# EAGLE design Light Sensor - Teensy (EAGLE 8.6.0)
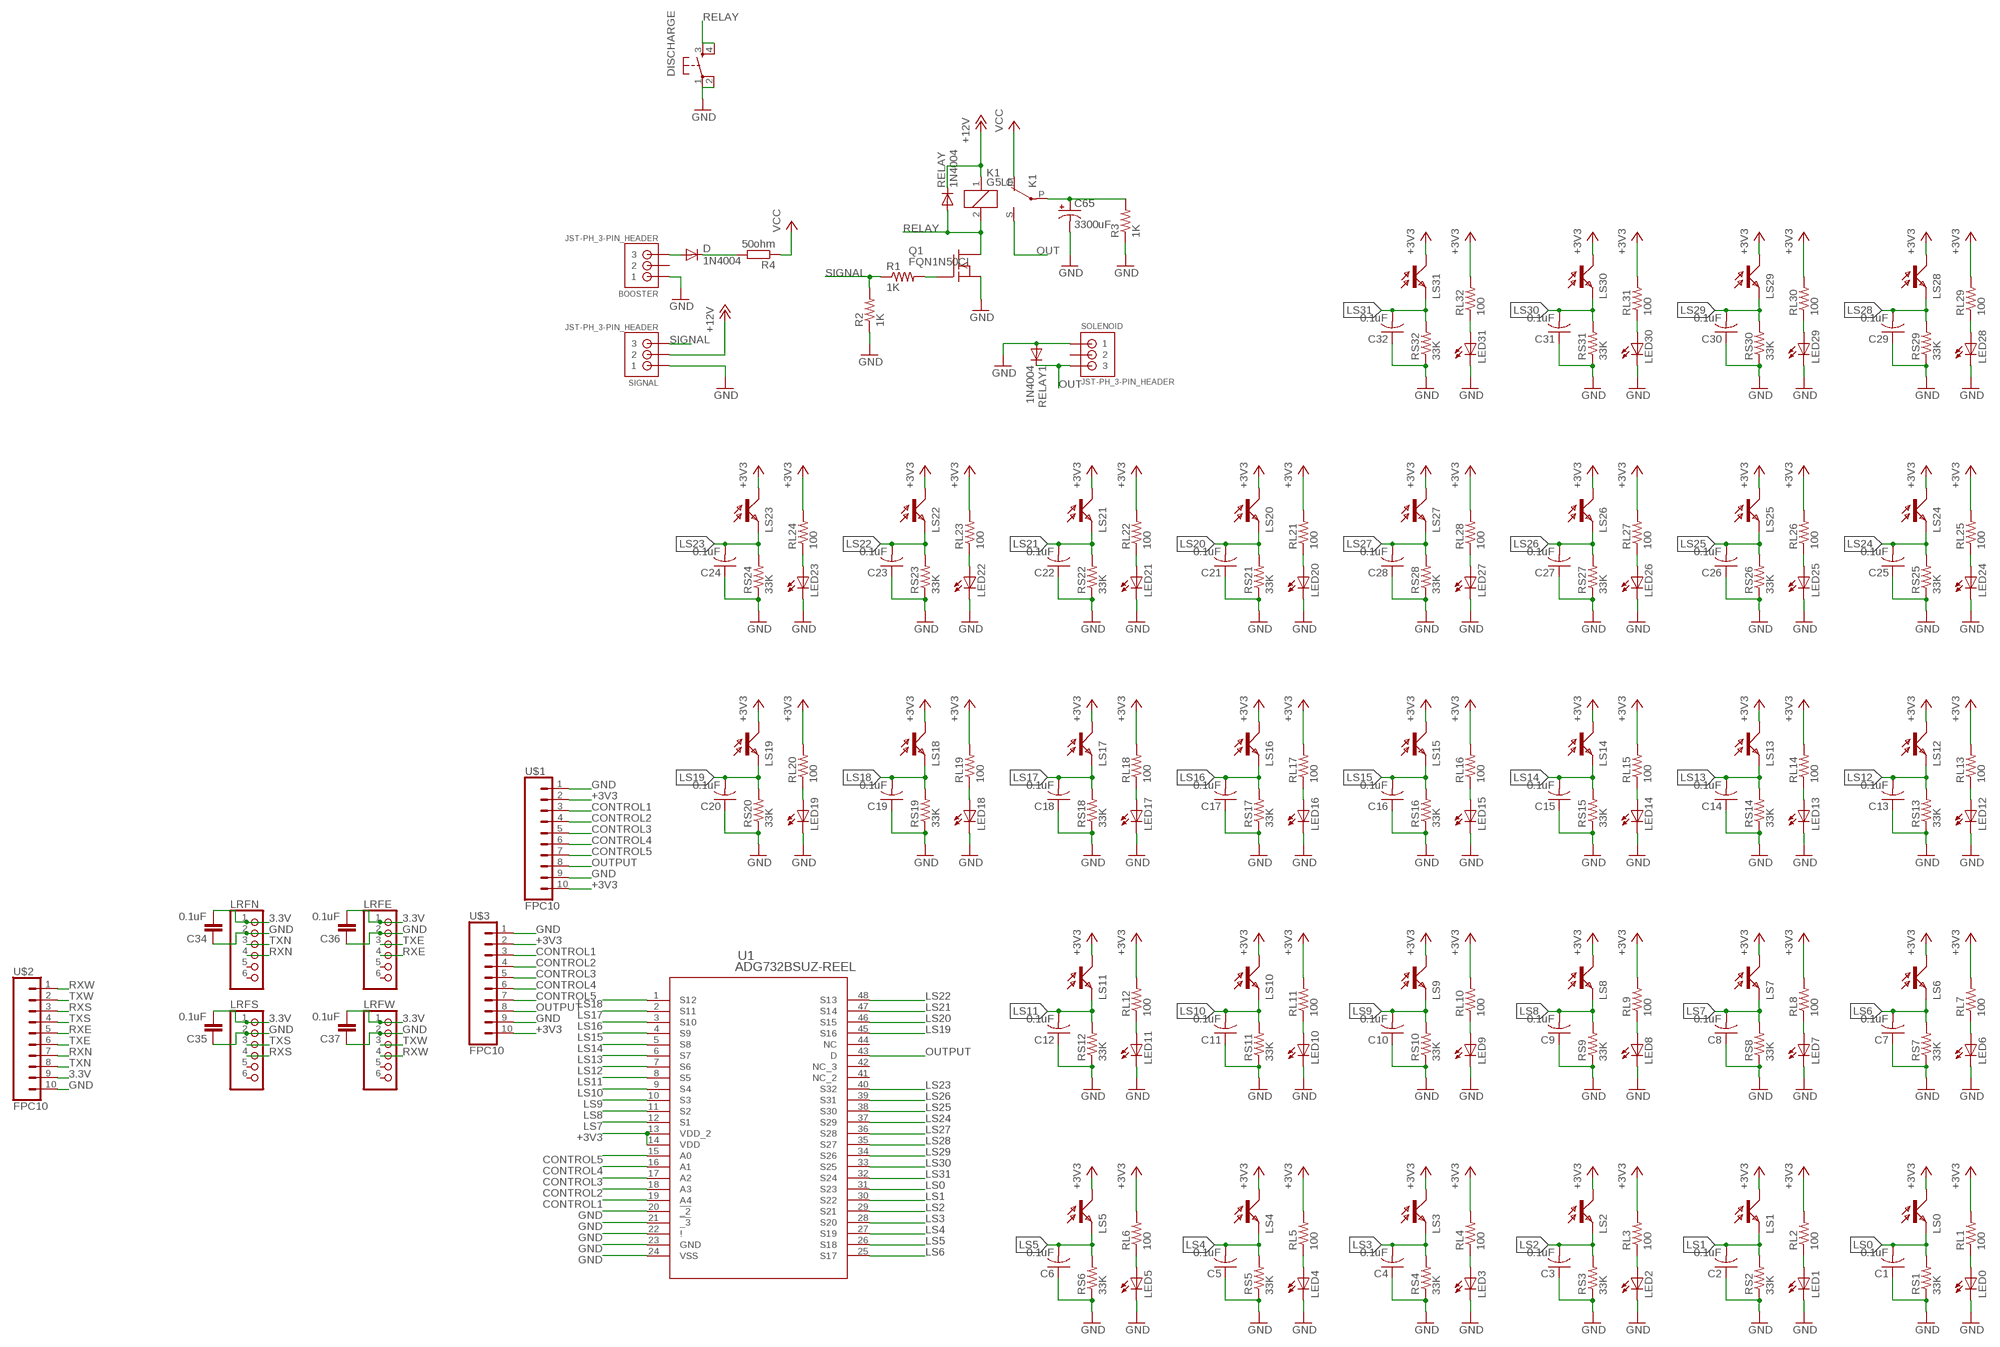
[diagram p0: schematic, sheet 1]

## Parts
BOOSTER  JST-PH_3-PIN_HEADER  [JST_B3B-PH_HEADER]
C1  0.1uF  C-USC0603  [C0603]
C2  0.1uF  C-USC0603  [C0603]
C3  0.1uF  C-USC0603  [C0603]
C4  0.1uF  C-USC0603  [C0603]
C5  0.1uF  C-USC0603  [C0603]
C6  0.1uF  C-USC0603  [C0603]
C7  0.1uF  C-USC0603  [C0603]
C8  0.1uF  C-USC0603  [C0603]
C9  0.1uF  C-USC0603  [C0603]
C10  0.1uF  C-USC0603  [C0603]
C11  0.1uF  C-USC0603  [C0603]
C12  0.1uF  C-USC0603  [C0603]
C13  0.1uF  C-USC0603  [C0603]
C14  0.1uF  C-USC0603  [C0603]
C15  0.1uF  C-USC0603  [C0603]
C16  0.1uF  C-USC0603  [C0603]
C17  0.1uF  C-USC0603  [C0603]
C18  0.1uF  C-USC0603  [C0603]
C19  0.1uF  C-USC0603  [C0603]
C20  0.1uF  C-USC0603  [C0603]
C21  0.1uF  C-USC0603  [C0603]
C22  0.1uF  C-USC0603  [C0603]
C23  0.1uF  C-USC0603  [C0603]
C24  0.1uF  C-USC0603  [C0603]
C25  0.1uF  C-USC0603  [C0603]
C26  0.1uF  C-USC0603  [C0603]
C27  0.1uF  C-USC0603  [C0603]
C28  0.1uF  C-USC0603  [C0603]
C29  0.1uF  C-USC0603  [C0603]
C30  0.1uF  C-USC0603  [C0603]
C31  0.1uF  C-USC0603  [C0603]
C32  0.1uF  C-USC0603  [C0603]
C34  0.1uF  0.1UF-0603-25V-(+80/-20%)  [0603]
C35  0.1uF  0.1UF-0603-25V-(+80/-20%)  [0603]
C36  0.1uF  0.1UF-0603-25V-(+80/-20%)  [0603]
C37  0.1uF  0.1UF-0603-25V-(+80/-20%)  [0603]
C65  3300uF  CPOL-USE10-22.5  [EB22,5D]
D  1N4004  [DO41-10]
DISCHARGE  TAC_SWITCHPTH  [TACTILE-PTH]
K1  G5LE  [G5LE]
LED0  LEDCHIPLED_0603  [CHIPLED_0603]
LED1  LEDCHIPLED_0603  [CHIPLED_0603]
LED2  LEDCHIPLED_0603  [CHIPLED_0603]
LED3  LEDCHIPLED_0603  [CHIPLED_0603]
LED4  LEDCHIPLED_0603  [CHIPLED_0603]
LED5  LEDCHIPLED_0603  [CHIPLED_0603]
LED6  LEDCHIPLED_0603  [CHIPLED_0603]
LED7  LEDCHIPLED_0603  [CHIPLED_0603]
LED8  LEDCHIPLED_0603  [CHIPLED_0603]
LED9  LEDCHIPLED_0603  [CHIPLED_0603]
LED10  LEDCHIPLED_0603  [CHIPLED_0603]
LED11  LEDCHIPLED_0603  [CHIPLED_0603]
LED12  LEDCHIPLED_0603  [CHIPLED_0603]
LED13  LEDCHIPLED_0603  [CHIPLED_0603]
LED14  LEDCHIPLED_0603  [CHIPLED_0603]
LED15  LEDCHIPLED_0603  [CHIPLED_0603]
LED16  LEDCHIPLED_0603  [CHIPLED_0603]
LED17  LEDCHIPLED_0603  [CHIPLED_0603]
LED18  LEDCHIPLED_0603  [CHIPLED_0603]
LED19  LEDCHIPLED_0603  [CHIPLED_0603]
LED20  LEDCHIPLED_0603  [CHIPLED_0603]
LED21  LEDCHIPLED_0603  [CHIPLED_0603]
LED22  LEDCHIPLED_0603  [CHIPLED_0603]
LED23  LEDCHIPLED_0603  [CHIPLED_0603]
LED24  LEDCHIPLED_0603  [CHIPLED_0603]
LED25  LEDCHIPLED_0603  [CHIPLED_0603]
LED26  LEDCHIPLED_0603  [CHIPLED_0603]
LED27  LEDCHIPLED_0603  [CHIPLED_0603]
LED28  LEDCHIPLED_0603  [CHIPLED_0603]
LED29  LEDCHIPLED_0603  [CHIPLED_0603]
LED30  LEDCHIPLED_0603  [CHIPLED_0603]
LED31  LEDCHIPLED_0603  [CHIPLED_0603]
LRFE  PINHD-1X6  [1X06]
LRFN  PINHD-1X6  [1X06]
LRFS  PINHD-1X6  [1X06]
LRFW  PINHD-1X6  [1X06]
LS0  ALS  [SMD]
LS1  ALS  [SMD]
LS2  ALS  [SMD]
LS3  ALS  [SMD]
LS4  ALS  [SMD]
LS5  ALS  [SMD]
LS6  ALS  [SMD]
LS7  ALS  [SMD]
LS8  ALS  [SMD]
LS9  ALS  [SMD]
LS10  ALS  [SMD]
LS11  ALS  [SMD]
LS12  ALS  [SMD]
LS13  ALS  [SMD]
LS14  ALS  [SMD]
LS15  ALS  [SMD]
LS16  ALS  [SMD]
LS17  ALS  [SMD]
LS18  ALS  [SMD]
LS19  ALS  [SMD]
LS20  ALS  [SMD]
LS21  ALS  [SMD]
LS22  ALS  [SMD]
LS23  ALS  [SMD]
LS24  ALS  [SMD]
LS25  ALS  [SMD]
LS26  ALS  [SMD]
LS27  ALS  [SMD]
LS28  ALS  [SMD]
LS29  ALS  [SMD]
LS30  ALS  [SMD]
LS31  ALS  [SMD]
Q1  FQN1N50CI  [TO92-INLINE]
R1  1K  1KOHM-1/4W-1%(PTH)  [AXIAL-0.3]
R2  1K  1KOHM-1/4W-1%(PTH)  [AXIAL-0.3]
R3  1K  1KOHM-1/4W-1%(PTH)  [AXIAL-0.3]
R4  50ohm  R0207/10  [0207/10]
RELAY  1N4004  [DO41-10]
RELAY1  1N4004  [DO41-10]
RL1  100  R-US_R0603  [R0603]
RL2  100  R-US_R0603  [R0603]
RL3  100  R-US_R0603  [R0603]
RL4  100  R-US_R0603  [R0603]
RL5  100  R-US_R0603  [R0603]
RL6  100  R-US_R0603  [R0603]
RL7  100  R-US_R0603  [R0603]
RL8  100  R-US_R0603  [R0603]
RL9  100  R-US_R0603  [R0603]
RL10  100  R-US_R0603  [R0603]
RL11  100  R-US_R0603  [R0603]
RL12  100  R-US_R0603  [R0603]
RL13  100  R-US_R0603  [R0603]
RL14  100  R-US_R0603  [R0603]
RL15  100  R-US_R0603  [R0603]
RL16  100  R-US_R0603  [R0603]
RL17  100  R-US_R0603  [R0603]
RL18  100  R-US_R0603  [R0603]
RL19  100  R-US_R0603  [R0603]
RL20  100  R-US_R0603  [R0603]
RL21  100  R-US_R0603  [R0603]
RL22  100  R-US_R0603  [R0603]
RL23  100  R-US_R0603  [R0603]
RL24  100  R-US_R0603  [R0603]
RL25  100  R-US_R0603  [R0603]
RL26  100  R-US_R0603  [R0603]
RL27  100  R-US_R0603  [R0603]
RL28  100  R-US_R0603  [R0603]
RL29  100  R-US_R0603  [R0603]
RL30  100  R-US_R0603  [R0603]
RL31  100  R-US_R0603  [R0603]
RL32  100  R-US_R0603  [R0603]
RS1  33K  R-US_R0603  [R0603]
RS2  33K  R-US_R0603  [R0603]
RS3  33K  R-US_R0603  [R0603]
RS4  33K  R-US_R0603  [R0603]
RS5  33K  R-US_R0603  [R0603]
RS6  33K  R-US_R0603  [R0603]
RS7  33K  R-US_R0603  [R0603]
RS8  33K  R-US_R0603  [R0603]
RS9  33K  R-US_R0603  [R0603]
RS10  33K  R-US_R0603  [R0603]
RS11  33K  R-US_R0603  [R0603]
RS12  33K  R-US_R0603  [R0603]
RS13  33K  R-US_R0603  [R0603]
RS14  33K  R-US_R0603  [R0603]
RS15  33K  R-US_R0603  [R0603]
RS16  33K  R-US_R0603  [R0603]
RS17  33K  R-US_R0603  [R0603]
RS18  33K  R-US_R0603  [R0603]
RS19  33K  R-US_R0603  [R0603]
RS20  33K  R-US_R0603  [R0603]
RS21  33K  R-US_R0603  [R0603]
RS22  33K  R-US_R0603  [R0603]
RS23  33K  R-US_R0603  [R0603]
RS24  33K  R-US_R0603  [R0603]
RS25  33K  R-US_R0603  [R0603]
RS26  33K  R-US_R0603  [R0603]
RS27  33K  R-US_R0603  [R0603]
RS28  33K  R-US_R0603  [R0603]
RS29  33K  R-US_R0603  [R0603]
RS30  33K  R-US_R0603  [R0603]
RS31  33K  R-US_R0603  [R0603]
RS32  33K  R-US_R0603  [R0603]
SIGNAL  JST-PH_3-PIN_HEADER  [JST_B3B-PH_HEADER]
SOLENOID  JST-PH_3-PIN_HEADER  [JST_B3B-PH_HEADER]
U1  ADG732BSUZ-REEL  [SU_48]
U$1  FPC10  [FPC10]
U$2  FPC10  [FPC10]
U$3  FPC10  [FPC10]

## Nets
3.3V: C34.2 C35.2 C36.2 C37.2 LRFE.1 LRFN.1 LRFS.1 LRFW.1 U$2.9
+3V3: LS0.C LS1.C LS2.C LS3.C LS4.C LS5.C LS6.C LS7.C LS8.C LS9.C LS10.C LS11.C LS12.C LS13.C LS14.C LS15.C LS16.C LS17.C LS18.C LS19.C LS20.C LS21.C LS22.C LS23.C LS24.C LS25.C LS26.C LS27.C LS28.C LS29.C LS30.C LS31.C RL1.2 RL2.2 RL3.2 RL4.2 RL5.2 RL6.2 RL7.2 RL8.2 RL9.2 RL10.2 RL11.2 RL12.2 RL13.2 RL14.2 RL15.2 RL16.2 RL17.2 RL18.2 RL19.2 RL20.2 RL21.2 RL22.2 RL23.2 RL24.2 RL25.2 RL26.2 RL27.2 RL28.2 RL29.2 RL30.2 RL31.2 RL32.2 U1.13(VDD_2) U1.14(VDD) U$1.2 U$1.10 U$3.2 U$3.10
+12V: K1.1 RELAY.C SIGNAL.P2
CHARGE: C65.+ K1.P(2:P) R3.P$2
CONTROL1: U1.19(A4) U$1.3 U$3.3
CONTROL2: U1.18(A3) U$1.4 U$3.4
CONTROL3: U1.17(A2) U$1.5 U$3.5
CONTROL4: U1.16(A1) U$1.6 U$3.6
CONTROL5: U1.15(A0) U$1.7 U$3.7
GND: BOOSTER.P1 C1.1 C2.1 C3.1 C4.1 C5.1 C6.1 C7.1 C8.1 C9.1 C10.1 C11.1 C12.1 C13.1 C14.1 C15.1 C16.1 C17.1 C18.1 C19.1 C20.1 C21.1 C22.1 C23.1 C24.1 C25.1 C26.1 C27.1 C28.1 C29.1 C30.1 C31.1 C32.1 C34.1 C35.1 C36.1 C37.1 C65.- DISCHARGE.1 DISCHARGE.2 LED0.C LED1.C LED2.C LED3.C LED4.C LED5.C LED6.C LED7.C LED8.C LED9.C LED10.C LED11.C LED12.C LED13.C LED14.C LED15.C LED16.C LED17.C LED18.C LED19.C LED20.C LED21.C LED22.C LED23.C LED24.C LED25.C LED26.C LED27.C LED28.C LED29.C LED30.C LED31.C LRFE.2 LRFN.2 LRFS.2 LRFW.2 Q1.3(S) R2.P$1 R3.P$1 RELAY1.A RS1.1 RS2.1 RS3.1 RS4.1 RS5.1 RS6.1 RS7.1 RS8.1 RS9.1 RS10.1 RS11.1 RS12.1 RS13.1 RS14.1 RS15.1 RS16.1 RS17.1 RS18.1 RS19.1 RS20.1 RS21.1 RS22.1 RS23.1 RS24.1 RS25.1 RS26.1 RS27.1 RS28.1 RS29.1 RS30.1 RS31.1 RS32.1 SIGNAL.P1 SOLENOID.P1 U1.20(!_2) U1.21(!_3) U1.22(!) U1.23(GND) U1.24(VSS) U$1.1 U$1.9 U$2.10 U$3.1 U$3.9
LS0: C1.2 LS0.E RS1.2 U1.31(S23)
LS1: C2.2 LS1.E RS2.2 U1.30(S22)
LS2: C3.2 LS2.E RS3.2 U1.29(S21)
LS3: C4.2 LS3.E RS4.2 U1.28(S20)
LS4: C5.2 LS4.E RS5.2 U1.27(S19)
LS5: C6.2 LS5.E RS6.2 U1.26(S18)
LS6: C7.2 LS6.E RS7.2 U1.25(S17)
LS7: C8.2 LS7.E RS8.2 U1.12(S1)
LS8: C9.2 LS8.E RS9.2 U1.11(S2)
LS9: C10.2 LS9.E RS10.2 U1.10(S3)
LS10: C11.2 LS10.E RS11.2 U1.9(S4)
LS11: C12.2 LS11.E RS12.2 U1.8(S5)
LS12: C13.2 LS12.E RS13.2 U1.7(S6)
LS13: C14.2 LS13.E RS14.2 U1.6(S7)
LS14: C15.2 LS14.E RS15.2 U1.5(S8)
LS15: C16.2 LS15.E RS16.2 U1.4(S9)
LS16: C17.2 LS16.E RS17.2 U1.3(S10)
LS17: C18.2 LS17.E RS18.2 U1.2(S11)
LS18: C19.2 LS18.E RS19.2 U1.1(S12)
LS19: C20.2 LS19.E RS20.2 U1.45(S16)
LS20: C21.2 LS20.E RS21.2 U1.46(S15)
LS21: C22.2 LS21.E RS22.2 U1.47(S14)
LS22: C23.2 LS22.E RS23.2 U1.48(S13)
LS23: C24.2 LS23.E RS24.2 U1.40(S32)
LS24: C25.2 LS24.E RS25.2 U1.37(S29)
LS25: C26.2 LS25.E RS26.2 U1.38(S30)
LS26: C27.2 LS26.E RS27.2 U1.39(S31)
LS27: C28.2 LS27.E RS28.2 U1.36(S28)
LS28: C29.2 LS28.E RS29.2 U1.35(S27)
LS29: C30.2 LS29.E RS30.2 U1.34(S26)
LS30: C31.2 LS30.E RS31.2 U1.33(S25)
LS31: C32.2 LS31.E RS32.2 U1.32(S24)
N$1: LED0.A RL1.1
N$2: LED1.A RL2.1
N$3: LED2.A RL3.1
N$4: LED3.A RL4.1
N$5: LED4.A RL5.1
N$6: LED5.A RL6.1
N$7: LED6.A RL7.1
N$8: LED7.A RL8.1
N$9: LED8.A RL9.1
N$10: LED9.A RL10.1
N$11: LED10.A RL11.1
N$12: LED11.A RL12.1
N$13: LED12.A RL13.1
N$14: LED13.A RL14.1
N$15: LED14.A RL15.1
N$16: LED15.A RL16.1
N$17: LED16.A RL17.1
N$18: LED17.A RL18.1
N$19: LED18.A RL19.1
N$20: LED19.A RL20.1
N$21: LED20.A RL21.1
N$22: LED21.A RL22.1
N$23: LED22.A RL23.1
N$24: LED23.A RL24.1
N$25: LED24.A RL25.1
N$26: LED25.A RL26.1
N$27: LED26.A RL27.1
N$28: LED27.A RL28.1
N$29: LED28.A RL29.1
N$30: LED29.A RL30.1
N$31: LED30.A RL31.1
N$32: LED31.A RL32.1
N$33: Q1.2(G) R1.P$2
N$34: BOOSTER.P3 D.A
N$35: D.C R4.2
OUT: K1.S(2:S) RELAY1.C SOLENOID.P3
OUTPUT: U1.43(D) U$1.8 U$3.8
RELAY: DISCHARGE.3 DISCHARGE.4 K1.2 Q1.1(D) RELAY.A
RXE: LRFE.4 U$2.5
RXN: LRFN.4 U$2.7
RXS: LRFS.4 U$2.3
RXW: LRFW.4 U$2.1
SIGNAL: R1.P$1 R2.P$2 SIGNAL.P3
TXE: LRFE.3 U$2.6
TXN: LRFN.3 U$2.8
TXS: LRFS.3 U$2.4
TXW: LRFW.3 U$2.2
VCC: K1.O(2:O) R4.1
Unconnected: BOOSTER.P2 LRFE.5 LRFE.6 LRFN.5 LRFN.6 LRFS.5 LRFS.6 LRFW.5 LRFW.6 SOLENOID.P2 U1.41(NC_2) U1.42(NC_3) U1.44(NC)

## Library data of the parts
BOOSTER SIGNAL SOLENOID = Kicker:JST-PH_3-PIN_HEADER: 3-pin JST PH Shrouded Header, top entry P/N B3B-PH-K-S Mating connector PHR-3
C1-C32 = adafruit:C-US: CAPACITOR, American symbol
C34-C37 = SparkFun-Capacitors:0.1UF: 0.1µF ceramic capacitors A capacitor is a passive two-terminal electrical component used to store electrical energy temporarily in an electric field.; PROD_ID: CAP-00810
C65 = adafruit:CPOL-US: POLARIZED CAPACITOR, American symbol
D RELAY RELAY1 = Kicker:1N4004: DIODE general purpose rectifier, 1 A
DISCHARGE = Kicker:TAC_SWITCH: Momentary Switch Button commonly used for reset or general input. Spark Fun Electronics SKU : COM-00097 SMT- SWCH-08247
K1 = Kicker:G5LE: RELAY 1 x switch, 10 A/120 V AC, 8 A/30 V DC, Omron; OC_FARNELL: unknown; OC_NEWARK: unknown
LED0 LED1-LED31 = adafruit:LED: LED OSRAM: - CHIPLED LG R971, LG N971, LY N971, LG Q971, LY Q971, LO R971, LY R971 LH N974, LH R974 LS Q976, LO Q976, LY Q976 LO Q996 - Hyper CHIPLED LW Q18S LB Q993, LB Q99A, LB R99A - SideLED LS A670, LO A670, LY A670, LG A670, LP A670 LB A673, LV A673, LT A673, LW A673 LH A674 LY A675 LS A676, LA A676, LO A676, LY A676, LW A676 LS A679, LY A679, LG A679 - Hyper Micro SIDELED® LS Y876, LA Y876, LO Y876, LY Y876 LT Y87S - SmartLED LW L88C, LW L88S LB L89C, LB L89S, LG L890 LS L89K, LO L89K, LY L89K LS L896, LA L896, LO L896, LY L896 - TOPLED LS T670, LO T670, LY T670, LG T670, LP T670 LSG T670, LSP T670, LSY T670, LOP T670, LYG T670 LG T671, LOG T671, LSG T671 LB T673, LV T673, LT T673, LW T673 LH T674 LS T676, LA T676, LO T676, LY T676, LB T676, LH T676, LSB T676, LW T676 LB T67C, LV T67C, LT T67C, LS T67K, LO T67K, LY T67K, LW E67C LS E67B, LA E67B, LO E67B, LY E67B, LB E67C, LV E67C, LT E67C LW T67C LS T679, LY T679, LG T679 LS T770, LO T770, LY T770, LG T770, LP T770 LB T773, LV T773, LT T773, LW T773 LH T774 LS E675, LA E675, LY E675, LS T675 LS T776, LA T776, LO T776, LY T776, LB T776 LHGB T686 LT T68C, LB T68C - Hyper Mini TOPLED® LB M676 - Mini TOPLED Santana® LG M470 LS M47K, LO M47K, LY M47K Source: http://www.osram.convergy.de/
LRFE LRFN LRFS LRFW = PinHead+:PINHD-1X6: PIN HEADER
LS0 LS1-LS31 = phototransitor-ALS-PT19-315CL177TR8:ALS
Q1 = Kicker:FQN1N50C: N-Channel Enhancement MOSFET 500V, 0.4A, 6.0 Ohm
R1-R3 = Kicker:1KOHM-1/4W-1%(PTH): RES-12182; PROD_ID: RES-12182
R4 = Kicker:R: RESISTOR, European symbol; SPICEMODEL: NONE; SPICEPREFIX: R
RL1-RL32 RS1-RS32 = adafruit:R-US_: RESISTOR, American symbol
U1 = ADG732:ADG732BSUZ-REEL; MANUFACTURER_PART_NUMBER: ADG732BSUZREEL; VENDOR: Analog Devices Inc
U$1-U$3 = FFC:FPC10

## Board
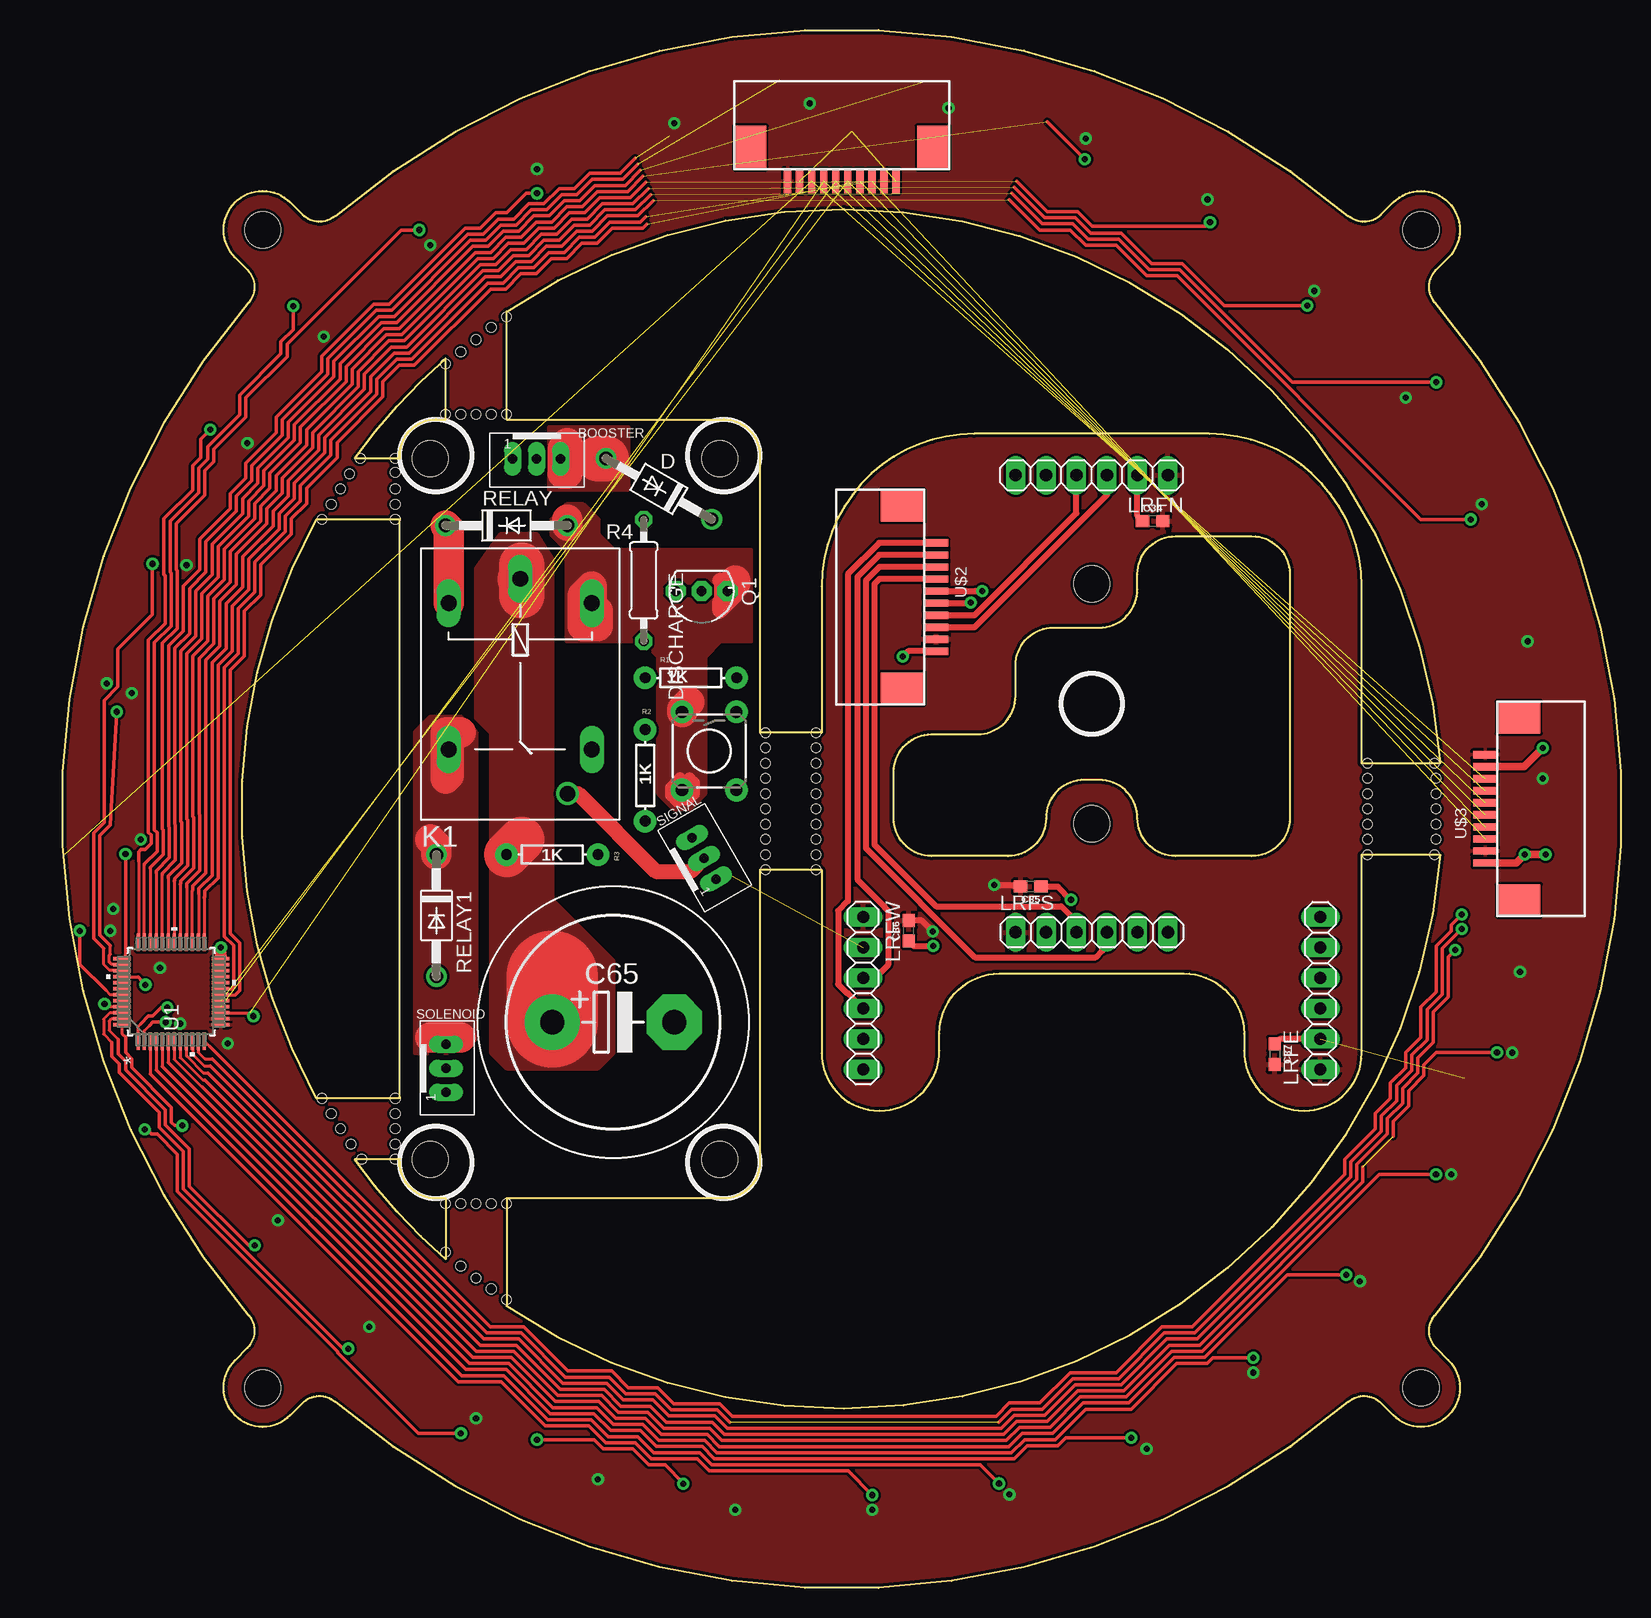
[diagram p1: board, top side]
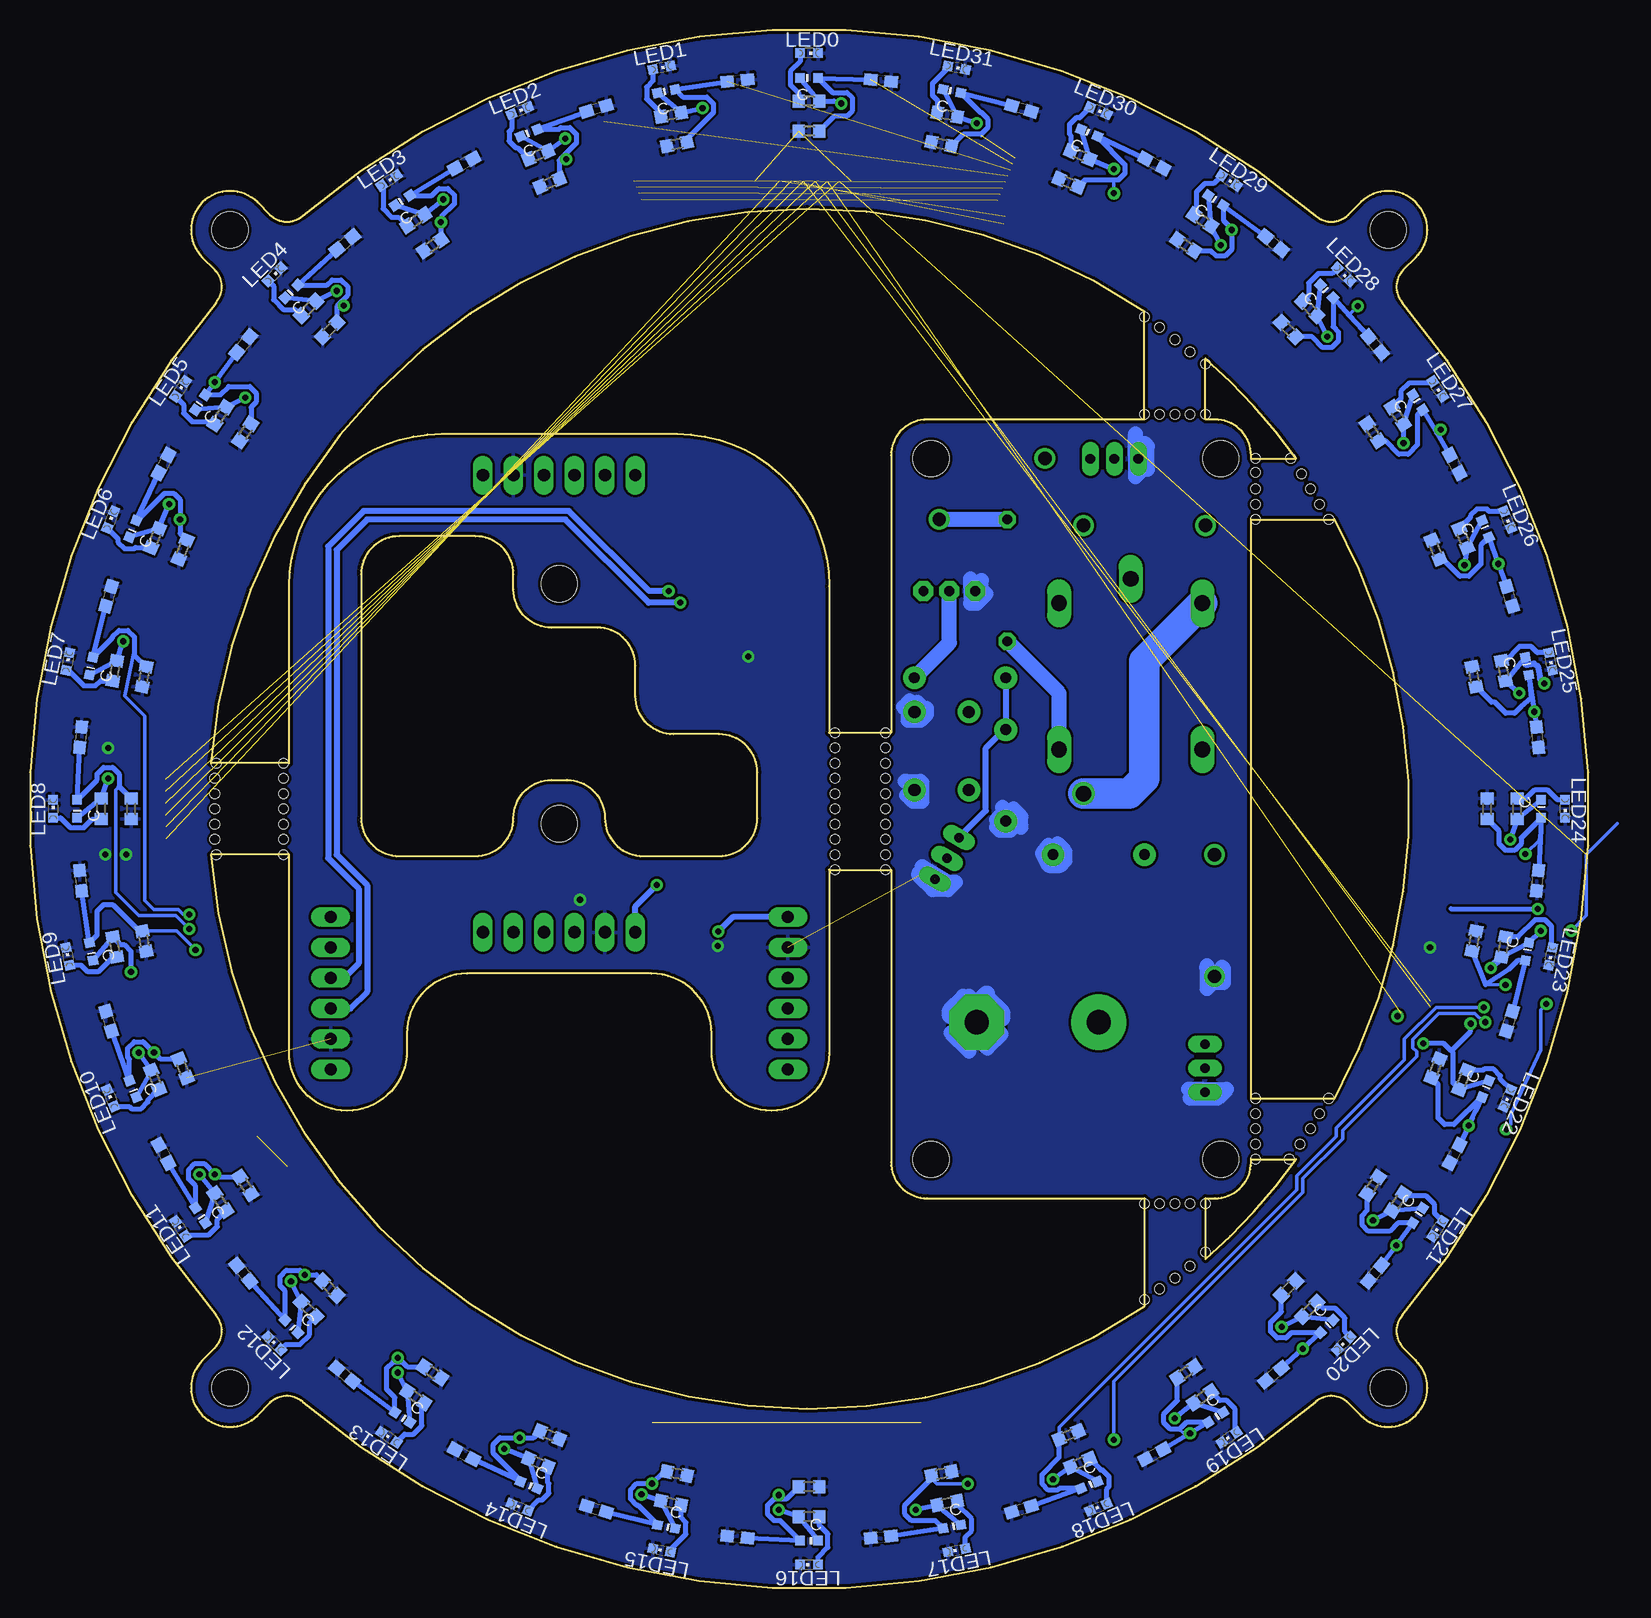
[diagram p2: board, bottom side, seen from below]

Size 129.86 x 129.86 mm. Coordinates in mm from the lower left corner, seen from the top.
Outline: 55.1,97.39 arc-90 58.1,94.39
Outline: 58.1,35.47 arc-90 55.1,32.47
Outline: 55.1,32.47 36.99,32.47 36.99,23.46 arc120 114.78,61.12 108.26,61.12 108.26,44.56 arc-90 103.46,39.76 arc-90 98.46,44.76 98.46,46.19 arc90 93.46,51.19 78.06,51.19 arc90 73.06,46.19 73.06,44.76 arc-90 68.06,39.76 arc-90 63.26,44.56 63.26,59.85 58.1,59.85 58.1,35.47
Outline: 55.1,97.39 36.99,97.39 36.99,106.39 arc-120 114.78,68.74 108.26,68.74 108.26,83.49 arc90 95.56,96.19 75.96,96.19 arc90 63.26,83.49 63.26,71.28 58.1,71.28 58.1,94.39
Outline: 55.1,97.39 arc-90 58.1,94.39
Outline: 58.1,35.47 arc-90 55.1,32.47
Outline: 31.91,32.47 31.1,32.47 arc-90 28.1,35.47 28.1,35.72 24.35,35.72 arc13 31.91,27.38 31.91,32.47
Outline: 28.1,40.8 28.1,89.06 21.14,89.06 arc58 21.14,40.8 28.1,40.8
Outline: 28.1,94.14 28.1,94.39 arc-90 31.1,97.39 31.91,97.39 31.91,102.47 arc13 24.35,94.14 28.1,94.14
Outline: 15.4,20 14.37,18.97 arc180 18.97,14.37 20,15.4 arc-86 22.71,15.51 arc81 107.15,15.51 arc-86 109.86,15.4 110.89,14.37 arc180 115.49,18.97 114.46,20 arc-86 114.35,22.71 arc81 114.35,107.15 arc-86 114.46,109.86 115.49,110.89 arc180 110.89,115.49 109.86,114.46 arc-86 107.15,114.35 arc81 22.71,114.35 arc-86 20,114.46 18.97,115.49 arc180 14.37,110.89 15.4,109.86 arc-86 15.51,107.15 arc81 15.51,22.71 arc-86 15.4,20
Outline: 72.42,71.15 76.23,71.15 arc90 79.41,74.33 79.41,76.87 arc-90 82.58,80.04 86.39,80.04 arc90 89.57,83.22 89.57,84.49 arc-90 92.74,87.66 99.09,87.66 arc-90 102.27,84.49 102.27,64.17 arc-90 99.09,60.99 92.74,60.99 arc-90 89.57,64.17 arc90 86.39,67.34 85.12,67.34 arc90 81.95,64.17 arc-90 78.77,60.99 72.42,60.99 arc-90 69.25,64.17 69.25,67.98 arc-90 72.42,71.15
Copper layers (1*16): Top 0.035mm / dielectric 1.5mm / Bottom 0.035mm
Design rules "SparkFun": minimum track width 8mil, minimum drill 20mil, track to track 8mil, track to pad 8mil, pad to pad 8mil, via to via 8mil, smd to smd 8mil, copper to edge 10mil, drill to drill 8mil, minimum pad ring 12mil, minimum via ring 10mil, stop-mask expansion 4mil, vias tented up to drill 25mil, thermal gap 10mil
Holes 3 mm at 16.67,16.67 113.19,16.67 16.67,113.19 113.19,113.19 30.64,94.14 54.77,94.14 30.64,35.72 54.77,35.72 85.76,83.69 85.76,63.69
Holes 0.79 mm at 31.91,102.01 33.18,103.03 34.45,104.04 35.72,105.06 36.99,105.95 24.8,94.14 23.91,92.87 23.14,91.6 22.38,90.33 21.62,89.06 24.92,35.72 24.03,36.99 23.14,38.26 22.38,39.53 21.62,40.8 36.99,24.03 35.72,24.92 34.45,25.81 33.18,26.83 31.91,27.97 27.72,40.8 27.72,39.53 27.72,38.26 27.72,36.99 27.72,35.72 36.99,32.03 35.72,32.03 34.45,32.03 33.18,32.03 31.91,32.03 27.72,92.99 27.72,94.14 27.72,91.6 27.72,90.33 27.72,89.06 31.91,97.82 33.18,97.82 34.45,97.82 35.72,97.82 36.99,97.82 58.58,71.28 58.58,70.01 58.58,68.74 58.58,67.47 58.58,66.2 58.58,64.93 58.58,63.66 58.58,62.39 58.58,61.12 58.58,59.85 62.77,71.28 62.77,70.01 62.77,68.74 62.77,67.47 62.77,66.2 62.77,64.93 62.77,63.66 62.77,62.39 62.77,61.12 62.77,59.85 114.33,68.74 114.46,67.47 114.46,66.2 114.46,64.93 114.46,63.66 114.46,62.39 114.33,61.12 108.74,68.74 108.74,67.47 108.74,66.2 108.74,64.93 108.74,63.66 108.74,62.39 108.74,61.12

### Footprints (pad centres in the part's own frame; a part is rotated, then mirrored left to right if it is on the bottom)
JST_B3B-PH_HEADER = drill 0.8 long: P1 2.027,0.048; P2 0.028,0.048; P3 -1.972,0.048
C0603 = smd 1.1 x 1: 1 -0.85,0; 2 0.85,0
0603 = smd 1.1 x 1: 1 -0.85,0; 2 0.85,0
EB22,5D = drill 2.007 pad 4.597: + -5.08,0 | drill 2.007 pad 4.597 octagon: - 5.08,0
DO41-10 = drill 1.118: A 5.08,0; C -5.08,0
TACTILE-PTH = drill 1.016 pad 1.88: 1 -3.251,2.261; 2 3.251,2.261; 3 -3.251,-2.261; 4 3.251,-2.261
G5LE = drill 1.321 long: 1 -7.493,-5.969; 2 -7.493,5.969; O 4.699,5.969; P -9.525,0; S 4.699,-5.969
CHIPLED_0603 = smd 0.8 x 0.8: A 0,-0.75; C 0,0.75
1X06 = drill 1.016 long: 1 -6.35,0; 2 -3.81,0; 3 -1.27,0; 4 1.27,0; 5 3.81,0; 6 6.35,0
SMD = smd 0.8 x 0.8: C -0.75,0; E 0.75,0
TO92-INLINE = drill 0.813 pad 1.676 octagon: 1 -2.159,0; 2 0,0; 3 2.159,0
AXIAL-0.3 = drill 0.9 pad 1.88: P$1 -3.81,0; P$2 3.81,0
0207/10 = drill 0.813 octagon: 1 -5.08,0; 2 5.08,0
R0603 = smd 1 x 1.1: 1 -0.85,0; 2 0.85,0
SU_48 = smd 1.473 x 0.279: 1 -4.115,2.75; 2 -4.115,2.25; 3 -4.115,1.75; 4 -4.115,1.25; 5 -4.115,0.75; 6 -4.115,0.25; 7 -4.115,-0.25; 8 -4.115,-0.75; 9 -4.115,-1.25; 10 -4.115,-1.75; 11 -4.115,-2.25; 12 -4.115,-2.75; 25 4.115,-2.75; 26 4.115,-2.25; 27 4.115,-1.75; 28 4.115,-1.25; 29 4.115,-0.75; 30 4.115,-0.25; 31 4.115,0.25; 32 4.115,0.75; 33 4.115,1.25; 34 4.115,1.75; 35 4.115,2.25; 36 4.115,2.75 | smd 0.279 x 1.473: 13 -2.75,-4.115; 14 -2.25,-4.115; 15 -1.75,-4.115; 16 -1.25,-4.115; 17 -0.75,-4.115; 18 -0.25,-4.115; 19 0.25,-4.115; 20 0.75,-4.115; 21 1.25,-4.115; 22 1.75,-4.115; 23 2.25,-4.115; 24 2.75,-4.115; 37 2.75,4.115; 38 2.25,4.115; 39 1.75,4.115; 40 1.25,4.115; 41 0.75,4.115; 42 0.25,4.115; 43 -0.25,4.115; 44 -0.75,4.115; 45 -1.25,4.115; 46 -1.75,4.115; 47 -2.25,4.115; 48 -2.75,4.115
FPC10 = smd 0.61 x 2.007: 1 -4.515,1.003; 2 -3.512,1.003; 3 -2.508,1.003; 4 -1.505,1.003; 5 -0.502,1.003; 6 0.502,1.003; 7 1.505,1.003; 8 2.508,1.003; 9 3.512,1.003; 10 4.515,1.003 | smd 2.667 x 3.607: N/C-1 -7.62,-1.803; N/C-2 7.62,-1.803

### Placement (x,y rotation side)
BOOSTER  39.53,94.14 180 top
C1  58.95,125.63 174.3 bottom
C2  70.91,125.63 185.6 bottom
C3  82.64,123.3 196.9 bottom
C4  93.68,118.73 208.1 bottom
C5  103.63,112.08 219.4 bottom
C6  112.08,103.63 230.6 bottom
C7  118.73,93.68 241.9 bottom
C8  123.3,82.64 253.1 bottom
C9  125.63,70.91 264.4 bottom
C10  125.63,58.95 275.6 bottom
C11  123.3,47.22 286.9 bottom
C12  118.73,36.17 298.1 bottom
C13  112.08,26.23 309.4 bottom
C14  103.63,17.77 320.6 bottom
C15  93.68,11.13 331.9 bottom
C16  82.64,6.55 343.1 bottom
C17  70.91,4.22 354.4 bottom
C18  58.95,4.22 5.6 bottom
C19  47.22,6.55 16.9 bottom
C20  36.17,11.13 28.1 bottom
C21  26.23,17.77 39.4 bottom
C22  17.77,26.23 50.6 bottom
C23  11.13,36.17 61.9 bottom
C24  6.55,47.22 73.1 bottom
C25  4.22,58.95 84.4 bottom
C26  4.22,70.91 95.6 bottom
C27  6.55,82.64 106.9 bottom
C28  11.13,93.68 118.1 bottom
C29  17.77,103.63 129.4 bottom
C30  26.23,112.08 140.6 bottom
C31  36.17,118.73 151.9 bottom
C32  47.22,123.3 163.1 bottom
C34  90.84,88.93 0 top
C35  80.68,58.45 180 top
C36  70.52,54.77 90 top
C37  101,44.48 270 top
C65  45.88,47.15 0 top
D  49.69,91.6 150 top
DISCHARGE  53.88,69.75 270 top
K1  38.13,74.58 270 top
LED0  64.93,127.93 270 bottom
LED1  77.22,126.72 281.2 bottom
LED2  89.04,123.13 292.5 bottom
LED3  99.93,117.31 303.7 bottom
LED4  109.48,109.48 315 bottom
LED5  117.31,99.93 326.2 bottom
LED6  123.13,89.04 337.5 bottom
LED7  126.72,77.22 348.7 bottom
LED8  127.93,64.93 0 bottom
LED9  126.72,52.64 11.2 bottom
LED10  123.13,40.82 22.5 bottom
LED11  117.31,29.93 33.7 bottom
LED12  109.48,20.38 45 bottom
LED13  99.93,12.55 56.2 bottom
LED14  89.04,6.72 67.5 bottom
LED15  77.22,3.14 78.7 bottom
LED16  64.93,1.93 90 bottom
LED17  52.64,3.14 101.2 bottom
LED18  40.82,6.72 112.5 bottom
LED19  29.93,12.55 123.7 bottom
LED20  20.38,20.38 135 bottom
LED21  12.55,29.93 146.2 bottom
LED22  6.72,40.82 157.5 bottom
LED23  3.14,52.64 168.7 bottom
LED24  1.93,64.93 180 bottom
LED25  3.14,77.22 191.2 bottom
LED26  6.72,89.04 202.5 bottom
LED27  12.55,99.93 213.7 bottom
LED28  20.38,109.48 225 bottom
LED29  29.93,117.31 236.2 bottom
LED30  40.82,123.13 247.5 bottom
LED31  52.64,126.72 258.7 bottom
LRFE  104.81,49.56 90 top
LRFN  85.76,92.74 180 top
LRFS  85.76,54.64 0 top
LRFW  66.71,49.56 270 top
LS0  64.93,125.85 0 bottom
LS1  76.83,124.76 11.2 bottom
LS2  88.27,121.28 22.5 bottom
LS3  98.82,115.65 33.7 bottom
LS4  108.06,108.06 45 bottom
LS5  115.65,98.82 56.2 bottom
LS6  121.28,88.27 67.5 bottom
LS7  124.76,76.83 78.7 bottom
LS8  125.93,64.93 90 bottom
LS9  124.76,53.03 101.2 bottom
LS10  121.28,41.58 112.5 bottom
LS11  115.65,31.04 123.7 bottom
LS12  108.06,21.79 135 bottom
LS13  98.82,14.21 146.2 bottom
LS14  88.27,8.57 157.5 bottom
LS15  76.83,5.1 168.7 bottom
LS16  64.93,3.93 180 bottom
LS17  53.03,5.1 191.2 bottom
LS18  41.58,8.57 202.5 bottom
LS19  31.04,14.21 213.7 bottom
LS20  21.79,21.79 225 bottom
LS21  14.21,31.04 236.2 bottom
LS22  8.57,41.58 247.5 bottom
LS23  5.1,53.03 258.7 bottom
LS24  3.93,64.93 270 bottom
LS25  5.1,76.83 281.2 bottom
LS26  8.57,88.27 292.5 bottom
LS27  14.21,98.82 303.7 bottom
LS28  21.79,108.06 315 bottom
LS29  31.04,115.65 326.2 bottom
LS30  41.58,121.28 337.5 bottom
LS31  53.03,124.76 348.7 bottom
Q1  53.24,83.09 180 top
R1  52.35,75.85 0 top
R2  48.54,67.72 90 top
R3  40.8,61.12 180 top
R4  48.42,83.98 90 top
RELAY  36.99,88.55 0 top
RELAY1  31.15,56.04 270 top
RL1  64.93,123.93 0 bottom
RL2  76.44,122.79 11.2 bottom
RL3  87.51,119.44 22.5 bottom
RL4  97.71,113.98 33.7 bottom
RL5  106.65,106.65 45 bottom
RL6  113.98,97.71 56.2 bottom
RL7  119.44,87.51 67.5 bottom
RL8  122.79,76.44 78.7 bottom
RL9  123.93,64.93 90 bottom
RL10  122.79,53.42 101.2 bottom
RL11  119.44,42.35 112.5 bottom
RL12  113.98,32.15 123.7 bottom
RL13  106.65,23.21 135 bottom
RL14  97.71,15.87 146.2 bottom
RL15  87.51,10.42 157.5 bottom
RL16  76.44,7.06 168.7 bottom
RL17  64.93,5.93 180 bottom
RL18  53.42,7.06 191.2 bottom
RL19  42.35,10.42 202.5 bottom
RL20  32.15,15.87 213.7 bottom
RL21  23.21,23.21 225 bottom
RL22  15.87,32.15 236.2 bottom
RL23  10.42,42.35 247.5 bottom
RL24  7.06,53.42 258.7 bottom
RL25  5.93,64.93 270 bottom
RL26  7.06,76.44 281.2 bottom
RL27  10.42,87.51 292.5 bottom
RL28  15.87,97.71 303.7 bottom
RL29  23.21,106.65 315 bottom
RL30  32.15,113.98 326.2 bottom
RL31  42.35,119.44 337.5 bottom
RL32  53.42,122.79 348.7 bottom
RS1  64.93,121.43 0 bottom
RS2  75.95,120.34 11.2 bottom
RS3  86.55,117.13 22.5 bottom
RS4  96.32,111.91 33.7 bottom
RS5  104.88,104.88 45 bottom
RS6  111.91,96.32 56.2 bottom
RS7  117.13,86.55 67.5 bottom
RS8  120.34,75.95 78.7 bottom
RS9  121.43,64.93 90 bottom
RS10  120.34,53.91 101.2 bottom
RS11  117.13,43.31 112.5 bottom
RS12  111.91,33.54 123.7 bottom
RS13  104.88,24.98 135 bottom
RS14  96.32,17.95 146.2 bottom
RS15  86.55,12.73 157.5 bottom
RS16  75.95,9.51 168.7 bottom
RS17  64.93,8.43 180 bottom
RS18  53.91,9.51 191.2 bottom
RS19  43.31,12.73 202.5 bottom
RS20  33.54,17.95 213.7 bottom
RS21  24.98,24.98 225 bottom
RS22  17.95,33.54 236.2 bottom
RS23  12.73,43.31 247.5 bottom
RS24  9.51,53.91 258.7 bottom
RS25  8.43,64.93 270 bottom
RS26  9.51,75.95 281.2 bottom
RS27  12.73,86.55 292.5 bottom
RS28  17.95,96.32 303.7 bottom
RS29  24.98,104.88 315 bottom
RS30  33.54,111.91 326.2 bottom
RS31  43.31,117.13 337.5 bottom
RS32  53.91,120.34 348.7 bottom
SIGNAL  53.39,60.8 300 top
SOLENOID  31.91,43.34 270 top
U1  9.05,49.69 90 top
U$1  64.93,118.27 180 top
U$2  71.79,82.58 270 top
U$3  119.54,64.93 90 top

### Tracks (layer width: path | path; a pad name or v marks a point on that pad's centre or on a via)
3.3V  (via drill 0.51)
  Top 0.508: v77.63,58.58 79.7,58.58 C35.2 | v72.5,54.72 71.6,55.62 C36.2
  Bottom 0.508: LRFS.1 79.41,56.8 v77.63,58.58 | LRFW.1 71.31,55.91 v72.5,54.72
  pour Top: 100.49,97.95 71.28,97.95 62.39,89.06 62.39,40.8 64.93,38.26 105.57,38.26 108.11,40.8 108.11,42.07 109.38,43.34 109.38,86.52 108.11,87.79 108.11,89.06 106.84,90.33 106.84,91.6
+3V3  (via drill 0.51)
  Top 0.508: 60.41,117.7 U$1.10 60.34,117.26
  Bottom 0.406: v50.96,122.08 RL32.2 LS31.C | v62.26,123.73 62.84,123.93 RL1.2 LS0.C | v73.82,123.35 RL2.2 LS1.C | v85.25,120.81 RL3.2 LS2.C | v95.41,115.73 RL4.2 LS3.C | v104.3,108.11 RL5.2 LS4.C | v111.92,99.22 RL6.2 LS5.C | v118.27,90.33 RL7.2 LS6.C | v122.08,78.9 RL8.2 LS7.C | v123.35,67.47 RL9.2 LS8.C | v120.81,44.61 RL11.2 LS10.C | v115.73,34.45 RL12.2 LS11.C | v108.11,25.56 RL13.2 LS12.C | v99.22,17.94 RL14.2 LS13.C | v90.33,11.59 RL15.2 LS14.C | v78.9,7.78 RL16.2 LS15.C | v67.47,6.51 RL17.2 LS16.C | v56.04,6.51 RL18.2 LS17.C | v44.61,9.05 RL19.2 LS18.C | v34.45,14.13 RL20.2 LS19.C | v25.56,21.75 RL21.2 LS20.C | v17.94,30.64 RL22.2 LS21.C | v3.97,54.77 4.95,53.78 LS23.C RL24.2 | v6.51,62.39 RL25.2 LS24.C | v5.75,74.58 RL26.2 LS25.C | v10.32,85.25 RL27.2 LS26.C | v15.4,95.41 RL28.2 LS27.C | v21.75,104.3 RL29.2 LS28.C | v30.64,111.92 RL30.2 LS29.C | v39.53,118.27 RL31.2 LS30.C | LS9.C RL10.2 122.32,53.61 122.01,53.61 121.44,53.05 v121.44,51.34 | LS22.C RL23.2 11.26,42.08 11.26,44.61 11.43,44.77 | 11.43,44.77 12.03,45.37 v13.75,45.37 | 11.43,44.77 9.81,46.39 v9.81,47.02 | 4.48,56.6 v4.22,56.6 11.44,56.6
  Bottom 0.508: LS25.C 5.25,76.97 5.19,76.92 4.54,77.05 4.23,76.84 4.01,75.73 v3.67,75.39
  Bottom 0.61: RL24.2 8.12,51.7 v8.12,51.66
  pour Top: 130.97,130.97 -27.78,130.97 -27.78,-1.11 130.97,-1.11
+12V  (via drill 1.27)  (1 unrouted)
  Top 1.27: v42.07,66.2 42.96,66.2 49.43,59.72 52.36,59.72 SIGNAL.P2
  Top 2.54: RELAY.C 32.16,88.3 K1.1
  Bottom 2.54: K1.1 36.99,77.25 36.99,67.47 38.26,66.2 v42.07,66.2
CHARGE
  Top 3.81: R3.P$2 38.26,62.39 | K1.P 38.26,83.98 | 38.26,83.98 38.26,82.71 | 38.26,83.98 38.26,85.25
  Top 7.62: 40.8,50.96 C65.+
  pour Top: 40.8,85.76 39.53,87.79 36.48,87.79 34.45,84.94 34.45,72.55 35.72,71.28 35.72,44.61 36.99,43.34 44.61,43.34 45.88,44.61 45.88,52.23 40.8,57.31
CONTROL1  (2 unrouted)
  Top 0.254: U1.19 14.12,49.94
  Top 0.305: 14.12,49.94 14.25,50.07 14.25,53.53 13.47,54.31 13.47,76.7 14.64,77.87 14.64,81.61 16.01,82.98 16.01,85.52 18.55,88.06 18.55,89.33 19.82,90.6 19.82,91.87 22.36,94.41 22.36,95.68 26.17,99.49 26.17,100.76 27.82,102.42 29.09,102.42 35.44,108.77 36.71,108.77 37.98,110.04 39.25,110.04 40.52,111.31 41.79,111.31 43.06,112.58 44.33,112.58 45.6,113.85 48.14,113.85 48.59,114.29
CONTROL2  (2 unrouted)
  Top 0.254: U1.18 14.4,49.44
  Top 0.305: 14.4,49.44 14.55,49.59 14.76,49.8 14.76,53.74 13.98,54.52 13.98,76.49 15.14,77.66 15.14,81.4 16.52,82.77 16.52,85.31 19.06,87.85 19.06,89.12 20.33,90.39 20.33,91.66 22.87,94.2 22.87,95.47 26.68,99.28 26.68,100.55 28.03,101.91 29.3,101.91 35.65,108.26 36.92,108.26 38.19,109.53 39.46,109.53 40.73,110.8 42,110.8 43.27,112.07 44.54,112.07 45.81,113.34 48.35,113.34 48.69,113.68
CONTROL3  (2 unrouted)
CONTROL4  (2 unrouted)
CONTROL5  (via drill 0.51)  (2 unrouted)
  Top 0.254: U1.15 15.61,47.94 v15.9,47.65
GND  (via drill 0.51)  (5 unrouted)
  Top 0.254: U1.24 U1.23 | U1.20 U1.21
  Top 0.508: LRFE.2 101.42,45.75 C37.1 | C36.1 70.94,53.5 v72.55,53.5 | C35.1 82.93,58.45 v84.03,57.36 | C34.1 89.57,89.35 LRFN.2 | U$2.10 70.45,78.07 v70.01,77.63
  Top 0.61: U$3.1 121.14,60.41 v121.85,61.12 v123.58,61.12 | U$3.9 121.78,68.44 v123.35,70.01
  Top 0.813: U1.23 U1.22 U1.21
  Top 1.016: U1.24 13.16,52.62 13.19,52.64 v13.19,53.37
  Bottom 1.27: BOOSTER.P1 37.75,94.34 | 37.75,94.34 37.75,96.17 | 37.75,94.34 37.75,92.61 37.11,93.25 36.73,93.25 36.73,95.15 36.99,95.41 | Q1.3 51.47,83.47 | 51.47,83.47 51.47,84.1 | 51.47,83.47 51.47,82.07 50.96,82.07 50.2,82.83 50.58,83.22 50.58,83.98 | DISCHARGE.1 56.14,73.59 55.91,73.82 55.4,73.31 55.15,73.31 55.15,72.8 55.66,72.29 56.67,72.29 56.67,73.06 57.05,73.44 56.55,73.94 | DISCHARGE.2 56.85,67.21 | 56.85,67.21 56.93,67.21 | 56.85,67.21 55.66,67.21 55.53,67.09 55.53,65.56 56.29,65.56 56.8,66.07 | SIGNAL.P1 55.48,60.1 | 55.48,60.1 55.53,60.1 54.26,58.83 53.37,58.83 | 53.37,58.83 52.74,58.83 53.37,58.2 54.64,58.2 55.78,59.34 55.78,59.59 | 55.48,60.1 53.37,58.83 | R3.P$1 44.99,61.88 45.5,61.24 44.99,60.23 43.97,60.23 43.59,60.61 43.59,61.37 44.23,62.01 | R2.P$1 48.8,64.17 48.8,64.55 | 48.8,65.05 48.8,64.55 | 48.8,64.55 49.31,64.04 49.31,63.4 49.05,63.15 48.16,63.15 48.04,63.28 48.04,64.29 47.27,63.53 | 47.27,63.53 47.27,63.4 | 47.27,63.53 47.27,64.29 47.91,64.93 | RELAY1.A 31.78,51.59 | 31.78,51.59 31.78,51.85 | 31.78,51.59 31.78,49.94 31.27,50.45 30.38,50.45 30.38,51.59 30.51,51.72 | C65.- 51.85,48.04 52.86,48.04 53.24,47.66 53.24,48.16 52.1,49.31 51.59,49.31 51.59,48.42 51.47,48.29 50.2,49.56 50.07,49.56 50.07,49.31 48.8,48.04 48.8,47.4 49.69,47.4 50.2,47.91 | 50.2,47.91 50.2,48.29 | 50.2,47.91 50.2,47.4 48.93,46.13 50.07,44.99 50.32,45.24 50.32,46.26 53.12,46.26 51.59,44.73 51.59,45.5 51.47,45.62 | SOLENOID.P1 32.2,41.56 | 32.2,41.56 33.3,41.56 | 32.2,41.56 30.13,41.56 30.89,40.8 33.18,40.8
  pour Bottom: 130.97,130.97 -27.78,130.97 -27.78,-1.11 130.97,-1.11
  pour Bottom: 26.83,100.49 26.83,29.37 58.58,29.37 58.58,100.49
LS0  (1 unrouted)
  Top 0.254: 8.8,59.16 U1.31
  Top 0.305: 47.94,118.67 46.67,117.4 44.13,117.4 42.86,116.13 41.59,116.13 40.32,114.86 39.05,114.86 37.78,113.59 36.51,113.59 35.24,112.32 33.97,112.32 27.62,105.97 26.35,105.97 22.61,102.23 22.61,100.96 18.8,97.15 18.8,95.88 16.26,93.34 16.26,92.07 14.99,90.8 14.99,89.53 12.45,86.99 12.45,84.45 11.08,83.08 11.08,79.34 9.84,78.1 9.84,63.86 9.91,63.8 9.91,60.44 8.81,59.34 8.81,59.22 8.8,59.21 8.8,59.16
  Bottom 0.406: RS1.2 62.82,122.69 61.75,122.69 61.35,123.1 61.35,124.23 61.75,124.64 62.97,124.64 LS0.E C1.2
LS1  (1 unrouted)
  Top 0.254: 9.3,58.89 U1.30
  Top 0.305: 48.15,118.17 46.88,116.9 44.34,116.9 43.07,115.63 41.8,115.63 40.53,114.36 39.26,114.36 37.99,113.09 36.72,113.09 35.45,111.82 34.18,111.82 27.83,105.47 26.56,105.47 23.12,102.02 23.12,100.75 19.31,96.94 19.31,95.67 16.77,93.13 16.77,91.86 15.5,90.59 15.5,89.32 12.96,86.78 12.96,84.24 11.59,82.87 11.59,79.13 10.35,77.89 10.35,64.08 10.42,64.01 10.42,60.23 9.32,59.13 9.32,58.96 9.3,58.94 9.3,58.89
  Bottom 0.406: RS2.2 75.12,120.76 72.9,122.97 72.9,123.73 73.44,124.26 75.45,124.26 LS1.E C2.2
LS2  (via drill 0.51)  (1 unrouted)
  Top 0.254: 9.8,58.61 U1.29
  Top 0.305: 48.36,117.66 47.09,116.39 44.55,116.39 43.28,115.12 42.01,115.12 40.74,113.85 39.47,113.85 38.2,112.58 36.93,112.58 35.66,111.31 34.39,111.31 28.04,104.96 26.77,104.96 23.63,101.81 23.63,100.54 19.82,96.73 19.82,95.46 17.28,92.92 17.28,91.65 16.01,90.38 16.01,89.11 13.47,86.57 13.47,84.03 12.1,82.66 12.1,78.92 10.86,77.68 10.86,64.29 10.93,64.22 10.93,60.02 9.83,58.92 9.83,58.7 9.8,58.67 9.8,58.61 | 82.03,122.23 v85.18,119.08
  Bottom 0.305: v85.18,119.08 85.68,119.08
  Bottom 0.406: C3.2 LS2.E 85.78,121.57 85.63,121.72 84.87,121.72 84.33,121.19 84.33,120.43 85.68,119.08 | RS3.2 85.76,119 85.26,119 v85.18,119.08
LS3  (via drill 0.51)  (1 unrouted)
  Top 0.254: U1.28 10.33,53.83 10.33,58.37
  Top 0.305: 48.57,117.15 47.3,115.88 44.76,115.88 43.49,114.61 42.22,114.61 40.95,113.34 39.68,113.34 38.41,112.07 37.14,112.07 35.87,110.8 34.6,110.8 28.25,104.45 26.98,104.45 24.14,101.6 24.14,100.33 20.33,96.52 20.33,95.25 17.79,92.71 17.79,91.44 16.52,90.17 16.52,88.9 13.98,86.36 13.98,83.82 12.6,82.45 12.6,78.71 11.37,77.47 11.37,64.5 11.44,64.43 11.44,59.81 10.34,58.71 10.34,58.49 10.33,58.48 10.33,58.37 | 79.53,117.25 82.07,114.71 84.61,114.71 85.82,113.5 95.29,113.5 v95.61,113.82
  Bottom 0.406: C4.2 LS3.E 96.36,116.06 95.79,116.64 95.03,116.64 94.49,116.11 94.49,115.35 95.61,114.23 v95.61,113.82 RS4.2
LS4  (via drill 0.51)  (1 unrouted)
  Top 0.254: U1.27 10.8,58.12 10.81,58.13 | 10.81,58.13 10.81,58.06 | 10.85,58.17 10.81,58.13
  Top 0.305: 48.78,116.64 47.51,115.37 44.97,115.37 43.7,114.1 42.43,114.1 41.16,112.83 39.89,112.83 38.62,111.56 37.35,111.56 36.08,110.29 34.81,110.29 28.46,103.94 27.19,103.94 24.64,101.39 24.64,100.12 20.83,96.31 20.83,95.04 18.29,92.5 18.29,91.23 17.02,89.96 17.02,88.69 14.48,86.15 14.48,83.61 13.11,82.24 13.11,78.5 11.94,77.33 11.94,59.6 10.85,58.5 10.85,58.17 | 79.32,116.74 81.86,114.2 84.4,114.2 85.67,112.93 88.21,112.93 90.75,110.39 93.29,110.39 96.79,106.89 v103.71,106.89
  Bottom 0.305: v103.71,106.89 103.77,106.83 104.28,106.83
  Bottom 0.406: C5.2 LS4.E 105.11,108.59 104.68,109.02 103.92,109.02 103.38,108.49 103.38,107.73 104.28,106.83 RS5.2
LS5  (via drill 0.51)  (1 unrouted)
  Top 0.254: U1.26 11.33,53.83 11.33,57.82
  Top 0.305: 48.99,116.13 47.72,114.86 45.18,114.86 43.91,113.59 42.64,113.59 41.37,112.32 40.1,112.32 38.83,111.05 37.56,111.05 36.29,109.78 35.02,109.78 28.67,103.43 27.4,103.43 25.15,101.18 25.15,99.91 21.34,96.1 21.34,94.83 18.8,92.29 18.8,91.02 17.53,89.75 17.53,88.48 14.99,85.94 14.99,83.4 13.62,82.03 13.62,78.29 12.45,77.12 12.45,59.39 11.35,58.29 11.35,57.96 11.33,57.93 11.33,57.82 | 79.11,116.24 81.65,113.7 84.19,113.7 85.46,112.43 88,112.43 90.54,109.89 93.08,109.89 102.48,100.49 v114.46,100.49
  Bottom 0.305: v114.46,100.49 LS5.E
  Bottom 0.406: C6.2 LS5.E 113.99,99.44 113.3,100.13 111.54,100.13 111,99.6 111,98.84 111.43,98.41 RS6.2
LS6  (via drill 0.51)  (1 unrouted)
  Top 0.254: U1.25 11.8,57.52 11.86,57.58
  Top 0.305: 49.2,115.63 47.93,114.36 45.39,114.36 44.12,113.09 42.85,113.09 41.58,111.82 40.31,111.82 39.04,110.55 37.77,110.55 36.5,109.28 35.23,109.28 28.88,102.93 27.61,102.93 25.66,100.97 25.66,99.7 21.85,95.89 21.85,94.62 19.31,92.08 19.31,90.81 18.04,89.54 18.04,88.27 15.5,85.73 15.5,83.19 14.13,81.82 14.13,78.08 12.96,76.91 12.96,59.18 11.86,58.08 11.86,57.64 | 78.9,115.73 81.44,113.19 83.98,113.19 85.25,111.92 87.79,111.92 90.33,109.38 92.87,109.38 113.19,89.06 v117.35,89.06 | 11.81,57.53 11.81,57.59 11.86,57.64 | 11.86,57.64 11.86,57.58 11.81,57.53 | 11.81,57.53 11.81,57.52
  Bottom 0.406: C7.2 LS6.E 120.92,88.96 118.65,91.24 117.89,91.24 117.35,90.71 v117.35,89.06 117.35,87.89 RS7.2
LS7  (via drill 0.51)
  Top 0.254: U1.12 12.25,45.12
  Top 0.305: 12.25,45.12 35.62,21.75 38.43,21.75 42.1,18.07 45.75,18.07 47.15,16.67 49.6,16.67 50.94,15.33 54.76,15.33 55.78,14.31 77.81,14.31 78.9,15.4 81.44,15.4 83.98,17.94 87.79,17.94 91.6,21.75 94.14,21.75 106.84,34.45 106.84,35.72 109.38,38.26 109.38,39.53 110.65,40.8 110.65,42.07 111.92,43.34 111.92,44.61 113.19,45.88 113.19,48.42 114.46,49.69 114.46,53.5 115.73,54.77 115.73,55.27 v116.59,56.13
  Bottom 0.305: v116.59,56.13 117.09,56.13 117.51,56.55 119.54,56.55 120.3,57.31 120.3,72.67 121.95,74.33 121.16,78.14
  Bottom 0.406: C8.2 LS7.E 122.99,79.18 122.99,79.28 122.46,79.81 121.7,79.81 121.16,79.28 121.16,78.14 121.16,77.77 RS8.2
LS8  (via drill 0.51)  (1 unrouted)
  Top 0.254: U1.11 11.3,44.64 11.84,44.1 12.48,44.1
  Top 0.305: 12.48,44.1 35.34,21.24 38.21,21.24 41.89,17.56 45.54,17.56 46.94,16.16 49.39,16.16 50.73,14.82 54.55,14.82 55.57,13.8 | 78.02,13.8 79.11,14.89 81.65,14.89 84.19,17.43 88,17.43 91.81,21.24 94.35,21.24 107.35,34.24 107.35,35.51 109.89,38.05 109.89,39.32 111.16,40.59 111.16,41.86 112.43,43.13 112.43,44.4 113.7,45.67 113.7,48.21 114.97,49.48 114.97,53.29 116.09,54.41 | 116.09,54.41 116.24,54.56 | 116.09,54.41 | 116.09,54.41 v116.59,54.91
  Bottom 0.305: v116.59,54.91 117.72,56.04 120.81,56.04 122.71,57.94 122.71,66.5 122.43,66.78
  Bottom 0.406: C9.2 LS8.E 124.26,67.34 124.26,67.85 123.73,68.38 122.97,68.38 122.43,67.85 122.43,66.78 RS9.2
LS9  (via drill 0.51)
  Top 0.254: U1.10 10.83,45.54 10.83,44.47 11.78,43.52 12.3,43.52
  Top 0.305: 12.3,43.52 35.08,20.73 38,20.73 41.68,17.05 45.33,17.05 46.73,15.65 49.18,15.65 50.52,14.31 54.34,14.31 55.36,13.29 78.23,13.29 79.32,14.38 81.86,14.38 84.4,16.92 88.21,16.92 92.02,20.73 94.56,20.73 107.85,34.03 107.85,35.3 110.39,37.84 110.39,39.11 111.66,40.38 111.66,41.65 112.93,42.92 112.93,44.19 114.2,45.46 114.2,48 115.47,49.27 115.47,50.96 115.47,51.47 115.47,52.57 v116.06,53.16
  Bottom 0.305: v116.06,53.16 117.64,54.74 RS10.2
  Bottom 0.406: C10.2 LS9.E 124.26,54.4 124.26,56.42 123.73,56.95 122.97,56.95 120.76,54.74 RS10.2
LS10  (via drill 0.51)  (1 unrouted)
  Top 0.254: U1.9 10.33,45.54 10.33,44.32 11.72,42.93 12.07,42.93
  Top 0.305: 108.36,35.09 108.36,33.82 94.77,20.22 92.23,20.22 88.42,16.41 84.61,16.41 82.07,13.87 79.53,13.87 78.44,12.78 55.15,12.78 54.13,13.81 50.31,13.81 48.97,15.14 46.52,15.14 45.11,16.54 41.47,16.54 37.79,20.22 34.78,20.22 12.07,42.93 | 110.9,37.63 110.9,38.9 112.17,40.17 112.17,41.44 113.44,42.71 113.44,43.59 114.47,44.62 v119.53,44.62
  Bottom 0.406: C11.2 LS10.E 121.57,44.08 121.72,44.23 121.72,44.99 121.19,45.52 120.43,45.52 v119.53,44.62 119,44.09 RS11.2
LS11  (via drill 0.51)
  Top 0.254: 11.85,42.35 11.65,42.35 9.8,44.2 U1.8
  Top 0.305: 11.85,42.35 34.48,19.72 37.58,19.72 41.26,16.04 44.9,16.04 46.31,14.64 48.76,14.64 50.1,13.3 53.92,13.3 54.94,12.27 78.65,12.27 79.74,13.37 82.28,13.37 84.82,15.91 88.63,15.91 92.44,19.72 94.98,19.72 109.72,34.46 v114.45,34.46
  Bottom 0.406: C12.2 LS11.E 116.06,33.49 116.64,34.07 116.64,34.83 116.11,35.36 115.35,35.36 v114.45,34.46 114.23,34.24 RS12.2
LS12  (via drill 0.51)
  Top 0.254: 11.62,41.76 11.59,41.76 9.3,44.06 U1.7
  Top 0.305: 11.62,41.76 34.18,19.21 37.37,19.21 41.05,15.53 44.69,15.53 46.1,14.13 48.55,14.13 49.89,12.79 53.71,12.79 54.73,11.77 78.86,11.77 79.95,12.86 82.49,12.86 85.03,15.4 88.84,15.4 92.65,19.21 95.19,19.21 102.07,26.09 v106.96,26.09
  Bottom 0.406: C13.2 LS12.E 108.59,24.75 109.02,25.18 109.02,25.94 108.49,26.47 107.35,26.47 v106.96,26.09 105.99,26.09 RS13.2
LS13  (via drill 0.51)
  Top 0.254: U1.6 8.8,43.78
  Top 0.305: 8.8,43.78 33.88,18.7 37.16,18.7 40.84,15.02 43.34,15.02 44.49,15.02 45.88,13.62 48.34,13.62 49.68,12.28 53.5,12.28 54.52,11.26 79.07,11.26 80.16,12.35 82.7,12.35 85.24,14.89 89.05,14.89 92.86,18.7 95.4,18.7 95.86,19.16 v99.22,19.16
  Bottom 0.305: v99.22,19.16 99.22,18.85
  Bottom 0.406: C14.2 LS13.E 99.44,15.86 100.13,16.55 100.13,18.32 99.6,18.85 99.22,18.85 98.84,18.85 98.41,18.42 RS14.2
LS14  (via drill 0.51)
  Top 0.254: U1.5 8.3,43.47
  Top 0.305: v89.06,12.5 83.57,12.5 82.91,11.84 80.37,11.84 79.28,10.75 54.31,10.75 53.29,11.77 49.47,11.77 48.13,13.11 45.67,13.11 44.28,14.51 43.13,14.51 40.63,14.51 36.95,18.19 33.58,18.19 8.3,43.47
  Bottom 0.406: C15.2 LS14.E 88.96,8.93 91.24,11.21 91.24,11.97 90.71,12.5 v89.06,12.5 87.89,12.5 RS15.2
LS15  (via drill 0.51)
  Top 0.254: U1.4 7.8,43.16
  Top 0.305: v78.03,8.69 76.48,10.24 54.1,10.24 53.08,11.27 49.26,11.27 47.92,12.6 45.46,12.6 44.07,14 42.92,14 40.42,14 36.74,17.68 33.28,17.68 7.8,43.16
  Bottom 0.406: C16.2 LS15.E 79.18,6.86 79.28,6.86 79.81,7.4 79.81,8.16 79.28,8.69 v78.03,8.69 77.04,9.68 RS16.2
LS16  (via drill 0.51)
  Top 0.254: U1.3 7.3,42.86
  Top 0.305: v67.47,7.73 65.46,9.73 53.89,9.73 52.87,10.76 49.05,10.76 47.71,12.1 45.25,12.1 43.86,13.49 40.21,13.49 36.53,17.18 32.98,17.18 7.3,42.86
  Bottom 0.305: v67.47,7.73 67.47,7.42
  Bottom 0.406: C17.2 LS16.E 67.34,5.59 67.85,5.59 68.38,6.13 68.38,6.89 67.85,7.42 67.47,7.42 66.78,7.42 RS17.2
LS17  (via drill 0.51)
  Top 0.254: U1.2 6.8,46.42 7.27,46.89
  Top 0.305: 7.27,46.89 7.52,47.15 v8.59,47.15 | v39.53,12.35 44.28,12.35 45.04,11.59 47.5,11.59 48.84,10.25 50.2,10.25 51.72,8.73 v51.72,8.67
  Bottom 0.305: v8.59,47.15 8.72,47.15 9.45,47.88 12.45,47.88 14.61,45.73 14.61,45.01 14.29,44.7 14.29,44.3 20.48,38.11 20.48,37.41 23.78,34.11 23.78,32.97 39.53,17.22 v39.53,12.35 | 54.74,9.1 54.31,8.67 53.53,8.67 53.53,8.66 53.52,8.67 v51.72,8.67
  Bottom 0.406: C18.2 LS17.E 54.4,5.59 56.42,5.59 56.95,6.13 56.95,6.89 54.74,9.1 RS18.2
LS18  (via drill 0.51)
  Top 0.254: U1.1 6.3,46.81 6.51,47.02
  Top 0.305: 6.51,47.02 7.14,47.66 7.52,47.66 8.23,48.37 v8.71,48.37
  Bottom 0.305: v8.71,48.37 9.22,48.37 9.24,48.39 12.66,48.39 15.32,45.74 15.32,43.99 20.99,38.32 20.99,37.62 24.29,34.32 24.29,33.18 44.09,13.37 RS19.2
  Bottom 0.406: C19.2 LS18.E 44.08,8.28 44.23,8.13 44.99,8.13 45.52,8.67 45.52,9.43 44.09,10.86 RS19.2
LS19  (via drill 0.51)
  Top 0.254: U1.45 3.71,48.44 v3.48,48.66
  Top 0.305: v6.85,38.22 6.97,38.22 7.37,37.82 7.87,37.82 9.55,36.14 9.55,33.06 22.93,19.69 22.93,19.57 29.63,12.87 v33.19,12.87
  Bottom 0.305: v3.48,48.66 3.97,48.18 3.97,44.84 6.39,39.64 6.45,39.5 6.45,38.61 v6.84,38.22 v6.85,38.22 | v33.19,12.87 33.73,12.87 34.07,13.21
  Bottom 0.406: C20.2 LS19.E 33.49,13.79 34.07,13.21 34.83,13.21 35.36,13.75 35.36,14.51 34.24,15.62 RS20.2
LS20  (via drill 0.51)
  Top 0.254: U1.46 4.9,47.91 3.91,47.91 3.41,47.4 3.41,46.16 4.09,45.47
  Top 0.305: v23.79,19.93 23.4,19.93 10.06,33.27 10.06,36.36 8.05,38.37 8.05,39.64 4.73,42.95 4.73,43.68 4.09,44.31 4.09,45.47
  Bottom 0.406: C21.2 v23.79,19.93 LS20.E 24.75,21.26 25.18,20.83 25.94,20.83 26.47,21.37 26.47,22.13 25.58,23.02 RS21.2
LS21  (via drill 0.51)
  Top 0.254: U1.47 4.9,47.41 4.06,47.41 3.87,47.21 3.87,46.48 4.63,45.71
  Top 0.305: 4.63,45.71 4.63,44.5 5.24,43.89 5.24,43.16 8.55,39.85 8.55,38.58 10.57,36.57 10.57,33.48 15.5,28.55 v16.01,28.55
  Bottom 0.406: C22.2 v16.01,28.55 LS21.E 15.86,30.41 16.55,29.72 18.32,29.72 18.85,30.26 18.85,31.02 18.42,31.45 RS22.2
LS22  (via drill 0.51)
  Top 0.254: U1.48 4.93,46.18 5.24,45.88
  Top 0.305: 5.24,45.88 5.24,44.61 5.75,44.1 5.75,43.38 9.06,40.06 9.06,38.79 9.32,38.53 v9.97,38.53
  Bottom 0.406: C23.2 v9.97,38.53 9.65,39.21 9.42,39.7 LS22.E 8.93,40.89 11.21,38.61 11.97,38.61 12.5,39.15 12.5,41.97 RS23.2
LS23  (via drill 0.51)
  Top 0.254: U1.40 6.3,50.94
  Top 0.305: 6.3,50.94 v6.9,50.27
  Bottom 0.305: v6.9,50.27 8.54,50.28
  Bottom 0.406: C24.2 LS23.E 5.87,52.29 6.61,51.55 8.54,50.28 RS24.2
LS24  (via drill 0.51)
  Top 0.254: U1.37 5.24,52.74 5.24,53.5
  Top 0.305: 5.24,53.5 v5.24,61.17
  Bottom 0.305: v5.24,61.17 4.01,62.39
  Bottom 0.406: C25.2 4.01,62.39 LS24.E 5.59,62.51 5.59,62.01 6.13,61.47 6.89,61.47 7.42,62.01 7.42,63.07 RS25.2
LS25  (via drill 0.51)
  Top 0.254: U1.38 4.9,51.97 4.06,51.97 3.87,52.16 3.87,52.71 3.97,52.82 3.97,53.5
  Top 0.305: 3.97,53.5 3.97,53.55 3.1,54.41 3.1,62.7 3.97,63.57 4.48,72.23 v4.5,73.02
  Bottom 0.406: C26.2 v4.5,73.02 LS25.E 4.74,74.19 5.59,73.46 5.59,73.44 6.13,72.9 6.89,72.9 7.42,73.44 7.42,73.46 7.78,73.82 8.05,73.82 RS26.2
LS26  (via drill 0.51)
  Top 0.254: U1.39 4.9,51.47 3.91,51.47 3.41,51.97 3.41,53.3
  Top 0.305: v7.48,85.35 7.48,81.14 4.6,78.26 4.6,75.11 3.46,73.96 3.46,63.78 2.6,62.91 2.6,54.11 3.41,53.3
  Bottom 0.406: C27.2 v7.48,85.35 LS26.E 8.95,86.91 8.95,85.32 9.94,84.33 10.7,84.33 12.13,85.76 RS27.2
LS27  (via drill 0.51)
  Top 0.254: U1.36 6.33,53.83 6.33,60.56
  Top 0.305: v12.31,96.55 11.5,95.74 11.5,94.22 10.83,93.54 10.83,91.51 8.44,89.12 8.44,84.47 8.54,84.37 8.54,80.39 7.14,79 7.14,62.97 7.37,62.75 7.37,62.03 6.87,61.52 6.51,61.52 6.33,61.34 6.33,60.56
  Bottom 0.305: v12.31,96.55 12.37,96.55 12.64,96.28
  Bottom 0.406: C28.2 12.64,96.28 LS27.E 14.23,97.75 14.23,95.28 15.02,94.49 15.78,94.49 16.89,95.61 RS28.2
LS28  (via drill 0.51)
  Top 0.254: 6.81,60.32 6.8,60.31 U1.35
  Top 0.305: v19.21,106.84 19.21,104.89 18.19,103.87 18.19,102.86 14.76,99.43 14.76,97.78 12.1,95.11 12.1,94.09 11.33,93.33 11.33,91.3 8.95,88.91 8.95,84.68 9.05,84.58 9.05,80.18 7.65,78.79 7.65,63.18 7.88,62.96 7.88,61.39 6.81,60.32 6.81,60.25
  Bottom 0.305: v19.21,106.84 19.93,106.11 19.93,106.06
  Bottom 0.406: C29.2 19.93,106.06 LS28.E 21.26,105.11 20.83,104.68 20.83,103.92 21.37,103.38 22.13,103.38 23.02,104.28 RS29.2
LS29  (via drill 0.51)
  Top 0.254: 7.3,59.98 U1.34
  Top 0.305: v29.72,113.19 28.22,113.19 18.7,103.66 18.7,102.65 15.27,99.22 15.27,97.57 12.6,94.9 12.6,93.88 11.84,93.12 11.84,91.09 9.45,88.7 9.45,84.89 9.56,84.79 9.56,79.97 8.32,78.74 8.32,63.23 8.39,63.17 8.39,61.11 7.3,60.02 7.3,59.98
  Bottom 0.406: C30.2 LS29.E 30.41,113.99 29.72,113.3 v29.72,113.19 29.72,111.54 30.26,111 31.02,111 31.45,111.43 RS30.2
LS30  (via drill 0.51)
  Top 0.254: 7.8,59.59 U1.33
  Top 0.305: v39.53,116.24 38.61,116.24 36.99,114.61 36.09,114.61 34.82,113.34 33.55,113.34 27.2,106.99 25.93,106.99 21.6,102.65 21.6,101.38 17.79,97.57 17.79,96.3 15.25,93.76 15.25,92.49 13.98,91.22 13.98,89.95 11.44,87.41 11.44,84.87 10.06,83.5 10.06,79.76 8.83,78.53 8.83,63.44 8.9,63.38 8.9,60.86 7.8,59.76 7.8,59.59
  Bottom 0.305: v39.53,116.24 39.53,117.35
  Bottom 0.406: C31.2 LS30.E 40.89,120.92 38.61,118.65 38.61,117.89 39.15,117.35 39.53,117.35 41.97,117.35 RS31.2
LS31  (1 unrouted)
  Top 0.254: U1.32 8.3,59.43
  Top 0.305: 47.73,119.18 46.46,117.91 43.92,117.91 42.65,116.64 41.38,116.64 40.11,115.37 38.84,115.37 37.57,114.1 36.3,114.1 35.03,112.83 33.76,112.83 27.41,106.48 26.14,106.48 22.1,102.44 22.1,101.17 18.29,97.36 18.29,96.09 15.75,93.55 15.75,92.28 14.48,91.01 14.48,89.74 11.94,87.2 11.94,84.66 10.57,83.29 10.57,79.55 9.34,78.32 9.34,63.65 9.4,63.59 9.4,60.65 8.31,59.55 8.31,59.44 | 8.31,59.44 8.31,59.43 | 8.3,59.43 8.31,59.44
  Bottom 0.305: 50.58,121.04 50.58,121.16
  Bottom 0.406: C32.2 LS31.E 50.67,122.99 50.58,122.99 50.04,122.46 50.04,121.7 50.58,121.16 52.08,121.16 RS32.2
N$1
  Bottom 0.406: LED0.A 65.68,127.22 66.48,126.42 66.48,125.28 65.78,124.57 RL1.1
N$2
  Bottom 0.406: LED1.A 77.95,125.61 78.47,125.1 78.47,124.12 77.27,122.92 RL2.1
N$3
  Bottom 0.406: LED2.A 89.73,121.59 89.93,121.4 89.93,120.6 89.36,120.03 89.21,120.03 RL3.1
N$4
  Bottom 0.406: LED3.A 100.43,116.77 100.43,114.94 99.73,114.24 99.15,114.24 RL4.1
N$5
  Bottom 0.406: LED4.A 109.56,108.5 109.56,107.36 108.76,106.56 107.76,106.56 RL5.1
N$6
  Bottom 0.406: LED5.A 117.05,98.63 117.05,97.91 116.35,97.21 114.67,97.21 RL6.1
N$7
  Bottom 0.406: LED6.A 122.53,87.46 122.53,87.18 121.97,86.62 121.17,86.62 121.07,86.72 RL7.1
N$8
  Bottom 0.406: LED7.A 126.69,76.48 125.39,75.19 124.41,75.19 124,75.6 RL8.1
N$9
  Bottom 0.406: LED8.A 127.3,64.18 126.5,63.37 125.36,63.37 124.65,64.08 RL9.1
N$10
  Bottom 0.406: LED9.A 125.61,51.9 125.1,51.39 124.12,51.39 122.92,52.58 RL10.1
N$11
  Bottom 0.406: LED10.A 121.59,40.13 121.4,39.93 120.6,39.93 120.03,40.49 120.03,40.64 RL11.1
N$12
  Bottom 0.406: LED11.A 116.77,29.43 114.94,29.43 114.24,30.12 114.24,30.71 RL12.1
N$13
  Bottom 0.406: LED12.A 108.5,20.29 107.36,20.29 106.56,21.1 106.56,22.09 RL13.1
N$14
  Bottom 0.406: LED13.A 98.63,12.8 97.91,12.8 97.21,13.5 97.21,15.19 RL14.1
N$15
  Bottom 0.406: LED14.A 87.46,7.32 87.18,7.32 86.62,7.89 86.62,8.68 86.72,8.79 RL15.1
N$16
  Bottom 0.406: LED15.A 76.48,3.17 75.19,4.46 75.19,5.45 75.6,5.86 RL16.1
N$17
  Bottom 0.406: LED16.A 64.18,2.55 63.37,3.36 63.37,4.5 64.08,5.2 RL17.1
N$18
  Bottom 0.406: LED17.A 51.9,4.24 51.39,4.75 51.39,5.74 52.58,6.93 RL18.1
N$19
  Bottom 0.406: LED18.A 40.13,8.26 39.93,8.46 39.93,9.26 40.49,9.82 40.64,9.82 RL19.1
N$20
  Bottom 0.406: LED19.A 29.43,13.09 29.43,14.91 30.12,15.61 30.71,15.61 RL20.1
N$21
  Bottom 0.406: LED20.A 20.29,21.35 20.29,22.49 21.1,23.3 22.09,23.3 RL21.1
N$22
  Bottom 0.406: LED21.A 12.8,31.23 12.8,31.95 13.5,32.65 15.19,32.65 RL22.1
N$23
  Bottom 0.406: LED22.A 7.32,42.4 7.32,42.68 7.89,43.24 8.68,43.24 8.79,43.13 RL23.1
N$24
  Bottom 0.406: RL24.1 5.86,54.25 4.43,55.68 3.59,55.68 3.05,55.15 3.05,53.43 LED23.A
N$25
  Bottom 0.406: LED24.A 2.55,65.68 3.36,66.48 4.5,66.48 5.2,65.78 RL25.1
N$26
  Bottom 0.406: LED25.A 4.24,77.95 4.75,78.47 5.74,78.47 6.93,77.27 RL26.1
N$27
  Bottom 0.406: LED26.A 8.26,89.73 8.46,89.93 9.26,89.93 9.82,89.36 9.82,89.21 RL27.1
N$28
  Bottom 0.406: LED27.A 13.09,100.43 14.91,100.43 15.61,99.73 15.61,99.15 RL28.1
N$29
  Bottom 0.406: LED28.A 21.35,109.56 22.49,109.56 23.3,108.76 23.3,107.76 RL29.1
N$30
  Bottom 0.406: LED29.A 31.23,117.05 31.95,117.05 32.65,116.35 32.65,114.67 RL30.1
N$31
  Bottom 0.406: LED30.A 42.4,122.53 42.68,122.53 43.24,121.97 43.24,121.17 43.13,121.07 RL31.1
N$32
  Bottom 0.406: LED31.A 53.37,126.69 54.66,125.39 54.66,124.41 54.25,124 RL32.1
N$33
  Bottom 1.27: R1.P$2 53.24,78.77 Q1.2
N$34
  Top 0.305: D.A
  Top 1.27: BOOSTER.P3 arc45 41.68,94.52 41.68,94.9
  Top 2.54: 42.07,95.41 42.07,92.87 41.68,92.87 41.68,94.9
  Top 3.81: D.A 44.61,94.14
  pour Top: 40.54,96.68 40.54,91.6 47.15,91.6 47.15,96.68
N$35
  Bottom 0.305: D.C 53.5,89.06
  Bottom 1.27: R4.2 53.5,89.06 D.C
OUT
  Top 1.27: SOLENOID.P3 32.06,45.41 arc-45 33.18,45.88
  Top 2.54: 33.18,45.88 30.64,45.88 | RELAY1.C 31.15,61.88 30.64,62.39 | K1.S 32.16,67.72 31.91,67.47 31.91,71.28 33.18,71.28
  pour Top: 29.37,44.61 33.18,44.61 34.45,45.88 34.45,71.28 33.18,72.55 30.64,72.55 29.37,71.28
OUTPUT  (via drill 0.51)  (2 unrouted)
  Top 0.254: U1.43 3.96,49.44 3.59,49.81
  Top 0.305: 3.59,49.81 1.43,51.97 v1.43,54.77
  Bottom 0.305: v1.43,54.77 0.16,56.04 0.16,61.12 -2.42,63.69
RELAY
  Top 1.016: DISCHARGE.4 51.62,66.86 52.23,67.47 52.61,67.09 52.61,66.2 52.1,65.69 51.34,65.69 51.21,65.56 50.7,66.07 50.7,66.71 51.47,67.47
  Top 1.27: Q1.1 55.66,83.09 56.04,82.71 54.77,81.44 54.77,82.24 54.92,82.39 54.92,83.78 54.77,83.94 54.77,83.98 55.02,83.72 56.04,83.72
  Top 2.54: K1.2 44.1,83.47 43.34,82.71 43.34,80.17 44.61,80.17 44.61,81.44 | RELAY.A 42.07,89.06 | 56.04,83.72 56.04,83.98 | DISCHARGE.3 51.62,73.21 52.23,73.82
  pour Top: 42.07,86.52 40.8,87.79 40.8,89.06 42.07,90.33 43.34,90.33 44.61,89.06 44.61,87.79 45.88,86.52 57.31,86.52 57.31,78.9 54.77,78.9 53.5,77.63 53.5,66.2 52.23,64.93 50.96,64.93 49.69,66.2 49.69,77.63 48.42,78.9 42.07,78.9
RXE  (via drill 0.51)
  Top 0.508: v76.64,83.09 v76.64,83.08 76.08,83.08 76.07,83.09 75.28,83.09 75.27,83.08 U$2.5
  Bottom 0.508: v76.64,83.09 78.27,83.09 84.95,89.77 94.14,89.77 94.39,89.77 102.05,89.77 105.01,86.81 105.01,60.82 102.47,58.28 102.47,52.02 103.66,50.83 LRFE.4
RXN
  Top 0.508: U$2.7 76,81.08 84.49,89.57 LRFN.4
RXS
  Top 0.508: U$2.3 68.05,85.09 66.93,83.97 66.93,61.65 76.03,52.56 86.09,52.56 86.64,53.12 86.64,54.26 LRFS.4
RXW
  Top 0.508: U$2.1 68.05,87.1 65.44,84.49 65.44,57.25 64.62,56.44 64.62,50.3 65.37,49.56 65.44,49.56 LRFW.4
SIGNAL  (1 unrouted)
  Bottom 0.508: R1.P$1 R2.P$2 48.67,71.53 50.2,70.01 50.2,64.78 SIGNAL.P3
TXE  (via drill 0.51)
  Top 0.508: U$2.6 74.45,82.08 74.45,82.07 75.63,82.07 v75.68,82.12
  Bottom 0.508: v75.68,82.12 78.31,82.12 85.25,89.06 101.76,89.06 104.3,86.52 104.3,61.12 101.76,58.58 101.76,49.69 103.15,48.29 LRFE.3
TXN
  Top 0.508: U$2.8 76,80.07 87.03,91.1 LRFN.3
TXS
  Top 0.508: U$2.4 68.05,84.09 67.65,83.68 67.65,61.95 72.79,56.8 83.22,56.8 84.61,55.4 84.49,55.28 LRFS.3
TXW
  Top 0.508: U$2.2 68.05,86.09 66.22,84.27 66.22,59.06 68.48,56.8 68.48,56.74 68.79,56.44 68.79,51.9 67.72,50.83 LRFW.3
VCC
  Bottom 1.27: K1.O 44.1,74.58 R4.1